# Altium project obc-comm.PrjPcb (part 1 of 2)
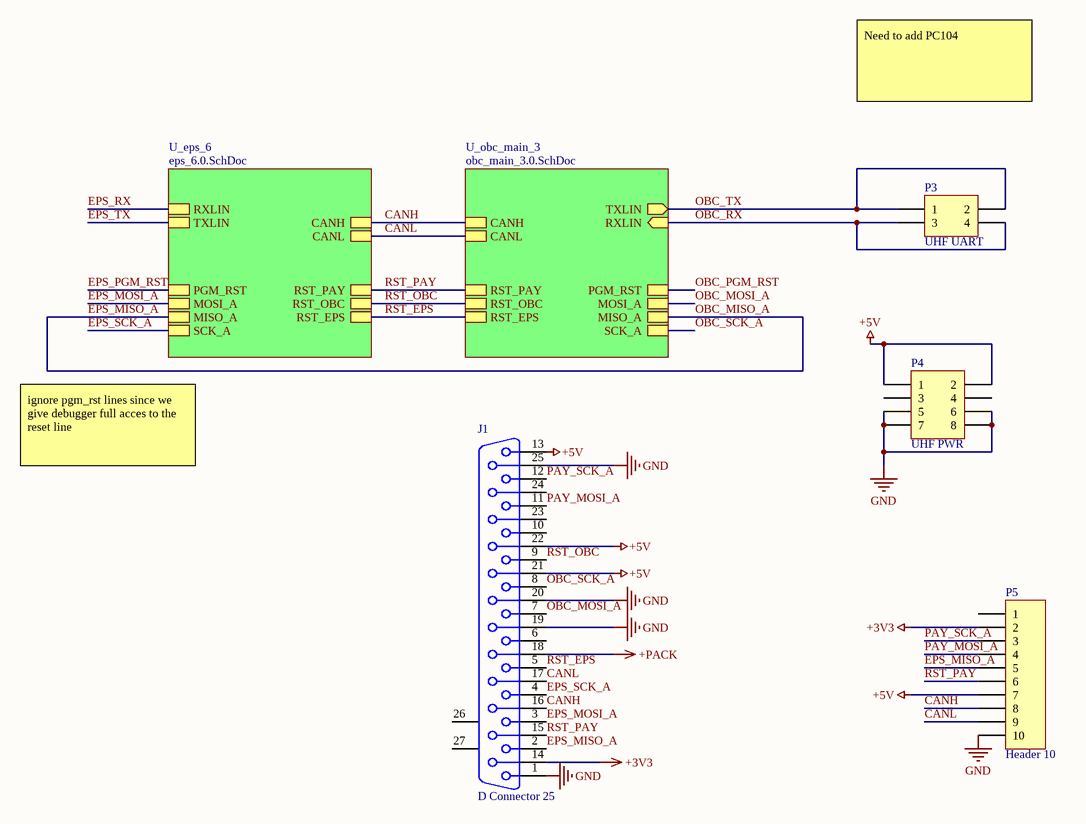
[diagram p0: bus-main.SchDoc]
19 sheets, 230 parts. Net scope: hierarchical (ports join the sheet entries above them; power ports are global).
Board file: obc_comm.PcbDoc
Sheets:
  bus-main.SchDoc
    U_obc_main_3 = obc_main_3.0.SchDoc
      U_obc_32m1 = obc_32m1.SchDoc
      U_obc_can_transceiver = obc_can_transceiver.SchDoc
      U_obc_flash = obc_flash.SchDoc
      U_obc_rtc = obc_rtc.SchDoc
      U_obc_flash = obc_flash.SchDoc
      U_obc_flash = obc_flash.SchDoc
    U_eps_6 = eps_6.0.SchDoc
      U_eps_digital = eps_digital.SchDoc
        U_eps_32m1 = eps_32m1.SchDoc
        U_eps_can_transceiver = eps_can_transceiver.SchDoc
        U_eps_flash = eps_flash.SchDoc
        U_eps_pex = eps_pex.SchDoc
        U_eps_adc = eps_adc.SchDoc
      U_eps_bb1 = eps_bb1.SchDoc
      U_eps_bb2 = eps_bb2.SchDoc
      U_eps_pv = eps_pv.SchDoc
      U_eps_bt1 = eps_bt1.SchDoc
      U_eps_bt2 = eps_bt2.SchDoc
      U_eps_batt = eps_batt.SchDoc

## Sheet bus-main.SchDoc
size A4

### Parts
J1  D Connector 25  [Mini DSub Connector]
P3  UHF UART  [HDR2X2]
P4  UHF PWR  [HDR2X4]
P5  Header 10  [DF14-10P-1.25H(55) - duplicate]

### Sub-sheets
U_eps_6 = eps_6.0.SchDoc: RXLIN, TXLIN, RST_PAY, RST_OBC, RST_EPS, SCK_A, PGM_RST, MOSI_A, MISO_A, CANL, CANH
U_obc_main_3 = obc_main_3.0.SchDoc: RST_OBC, RST_EPS, CANL, RST_PAY, CANH, TXLIN (out), RXLIN (in), PGM_RST, MOSI_A, MISO_A, SCK_A

### Nets
+3V3: J1.14 P5.2
+5V: J1.13 J1.21 J1.22 P4.1 P4.2 P5.7
+PACK: J1.18
GND: J1.1 J1.19 J1.20 J1.25 P4.5 P4.6 P4.7 P4.8 P5.10
CANH: J1.16 P5.8 ; sheet U_obc_main_3/CANH, sheet U_eps_6/CANH
CANL: J1.17 P5.9 ; sheet U_obc_main_3/CANL, sheet U_eps_6/CANL
EPS_MISO_A: J1.2 P5.5 ; sheet U_obc_main_3/MISO_A, sheet U_eps_6/MISO_A  [also labelled OBC_MISO_A]
EPS_MOSI_A: J1.3 ; sheet U_eps_6/TXLIN, sheet U_eps_6/MOSI_A  [also labelled EPS_TX]
EPS_SCK_A: J1.4 ; sheet U_eps_6/SCK_A
OBC_MOSI_A: J1.7 P3.1 P3.2 ; sheet U_obc_main_3/TXLIN, sheet U_obc_main_3/MOSI_A  [also labelled OBC_TX]  [project net MOSI_A]
OBC_RX: P3.3 P3.4 ; sheet U_obc_main_3/RXLIN
OBC_SCK_A: J1.8 ; sheet U_obc_main_3/SCK_A
PAY_MOSI_A: J1.11 P5.4
PAY_SCK_A: J1.12 P5.3
RST_EPS: J1.5 ; sheet U_obc_main_3/RST_EPS, sheet U_eps_6/RST_EPS
RST_OBC: J1.9 ; sheet U_obc_main_3/RST_OBC, sheet U_eps_6/RST_OBC  [project net RST]
RST_PAY: J1.15 P5.6 ; sheet U_obc_main_3/RST_PAY, sheet U_eps_6/RST_PAY

Not connected (* = marked no-connect by the designer): J1 6 10 23 24 26(MH1) 27(MH2); P4 3 4; P5 1

### Notes on the sheet
- Need to add PC104
- ignore pgm_rst lines since we give debugger full acces to the reset line

### Library data of the parts
J1 = D Connector 25: Receptacle Assembly, 25 Position, Right Angle; PackageDocument: U; Positions: 25; Published: 15-Jun-2001; LatestRevisionDate: 17-Jul-2002; LatestRevisionNote: Re-released for DXP Platform.; DatasheetDocument: 19-Mar-1999; PackageReference: 787202; Publisher: Altium Limited; Orientation: Right Angle; Gender: Receptacle; ComponentLink1Description: Mini-D25 - Molex, LLC 0836149012; ComponentLink1URL: https://www.digikey.ca/product-detail/en/molex-llc/0836149012/WM2144-ND/1867000
P3 = Header 2X2: Header, 2-Pin, Dual row; LatestRevisionDate: 17-Jul-2002; LatestRevisionNote: Re-released for DXP Platform.; Publisher: Altium Limited
P4 = Header 4X2: Header, 4-Pin, Dual row; LatestRevisionDate: 17-Jul-2002; LatestRevisionNote: Re-released for DXP Platform.; Publisher: Altium Limited
P5 = Header 10: Header, 10-Pin; LatestRevisionDate: 17-Jul-2002; LatestRevisionNote: Re-released for DXP Platform.; Publisher: Altium Limited

## Sheet obc_main_3.0.SchDoc
size A
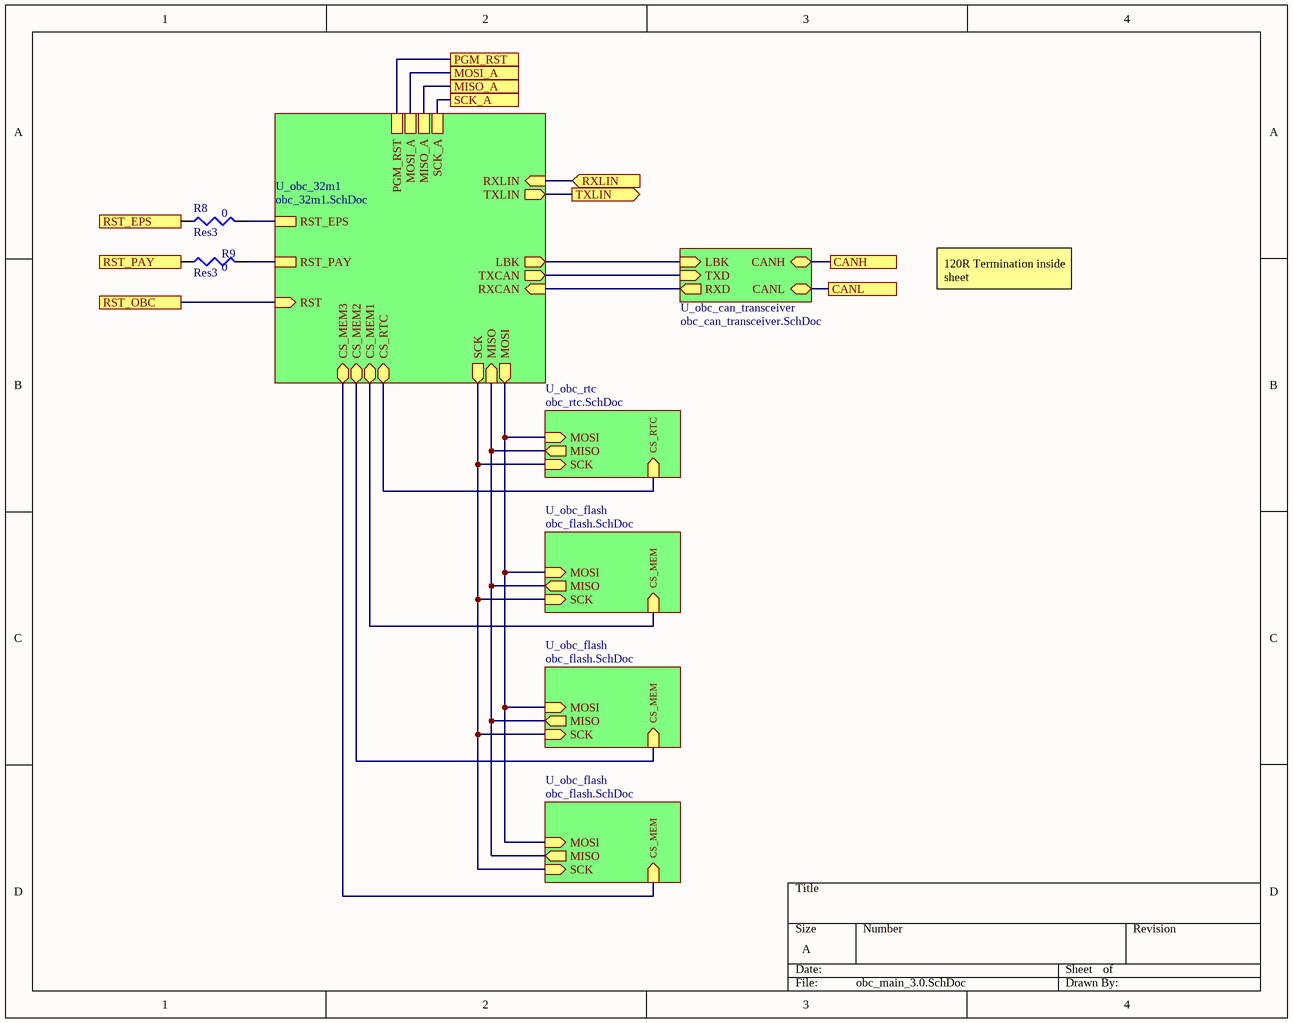
[diagram p1: obc_main_3.0.SchDoc]

### Parts
R8  Res3  value 0  [J1-0603]
R9  Res3  value 0  [J1-0603]

### Sub-sheets
U_obc_32m1 = obc_32m1.SchDoc: MISO (in), SCK (out), CS_MEM3 (bidir), CS_MEM1 (bidir), CS_MEM2 (bidir), RXLIN (in), CS_RTC (bidir), TXLIN (out), TXCAN (out), RXCAN (in), MOSI (out), LBK (out), RST (in), RST_EPS, RST_PAY, PGM_RST, MOSI_A, MISO_A, SCK_A
U_obc_can_transceiver = obc_can_transceiver.SchDoc: RXD (out), TXD (in), LBK (in), CANL (bidir), CANH (bidir)
U_obc_flash = obc_flash.SchDoc: MOSI (in), SCK (in), MISO (out), CS_MEM (in)
U_obc_flash = obc_flash.SchDoc: MOSI (in), SCK (in), MISO (out), CS_MEM (in)
U_obc_flash = obc_flash.SchDoc: MOSI (in), SCK (in), MISO (out), CS_MEM (in)
U_obc_rtc = obc_rtc.SchDoc: CS_RTC (in), MOSI (in), MISO (out), SCK (in)

### Ports
CANH, CANL, MISO_A, MOSI_A, PGM_RST, RST_EPS, RST_OBC, RST_PAY, RXLIN (in), SCK_A, TXLIN (out)

### Nets
CANH: port CANH, sheet U_obc_can_transceiver/CANH
CANL: port CANL, sheet U_obc_can_transceiver/CANL
EPS_MISO_A: port MISO_A, sheet U_obc_32m1/MISO_A
MOSI_A: port TXLIN, port MOSI_A, sheet U_obc_32m1/TXLIN, sheet U_obc_32m1/MOSI_A
OBC_PGM_RST: port PGM_RST, sheet U_obc_32m1/PGM_RST
OBC_RX: port RXLIN, sheet U_obc_32m1/RXLIN
OBC_SCK_A: port SCK_A, sheet U_obc_32m1/SCK_A
RST: port RST_OBC, sheet U_obc_32m1/RST
RST_EPS: R8.1 ; port RST_EPS
RST_PAY: R9.1 ; port RST_PAY
RXCAN: sheet U_obc_32m1/RXCAN, sheet U_obc_can_transceiver/RXD
TXCAN: sheet U_obc_32m1/TXCAN, sheet U_obc_can_transceiver/TXD
NetOBC-MEM1_1: sheet U_obc_32m1/CS_MEM3, sheet U_obc_flash/CS_MEM
NetOBC-MEM1_2: sheet U_obc_32m1/MISO, sheet U_obc_flash/MISO, sheet U_obc_rtc/MISO, sheet U_obc_flash/MISO, sheet U_obc_flash/MISO
NetOBC-MEM1_5: sheet U_obc_32m1/MOSI, sheet U_obc_flash/MOSI, sheet U_obc_rtc/MOSI, sheet U_obc_flash/MOSI, sheet U_obc_flash/MOSI
NetOBC-MEM1_6: sheet U_obc_32m1/SCK, sheet U_obc_flash/SCK, sheet U_obc_rtc/SCK, sheet U_obc_flash/SCK, sheet U_obc_flash/SCK
NetOBC-MEM2_1: sheet U_obc_32m1/CS_MEM2, sheet U_obc_flash/CS_MEM
NetOBC-MEM3_1: sheet U_obc_32m1/CS_MEM1, sheet U_obc_flash/CS_MEM
NetR8_2: R8.2 ; sheet U_obc_32m1/RST_EPS
NetR9_2: R9.2 ; sheet U_obc_32m1/RST_PAY
NetR30_2: sheet U_obc_32m1/LBK, sheet U_obc_can_transceiver/LBK
NetU1_26: sheet U_obc_32m1/CS_RTC, sheet U_obc_rtc/CS_RTC

### Notes on the sheet
- 120R Termination inside sheet

### Library data of the parts
R8 R9 = Res3: Resistor; Published: 8-Jun-2000; LatestRevisionDate: 29-May-2009; LatestRevisionNote: IPC-7351 Footprint Added.; PackageReference: J1-0603; Publisher: Altium Limited; PackageDescription: Chip Resistor

## Sheet obc_32m1.SchDoc
size A4
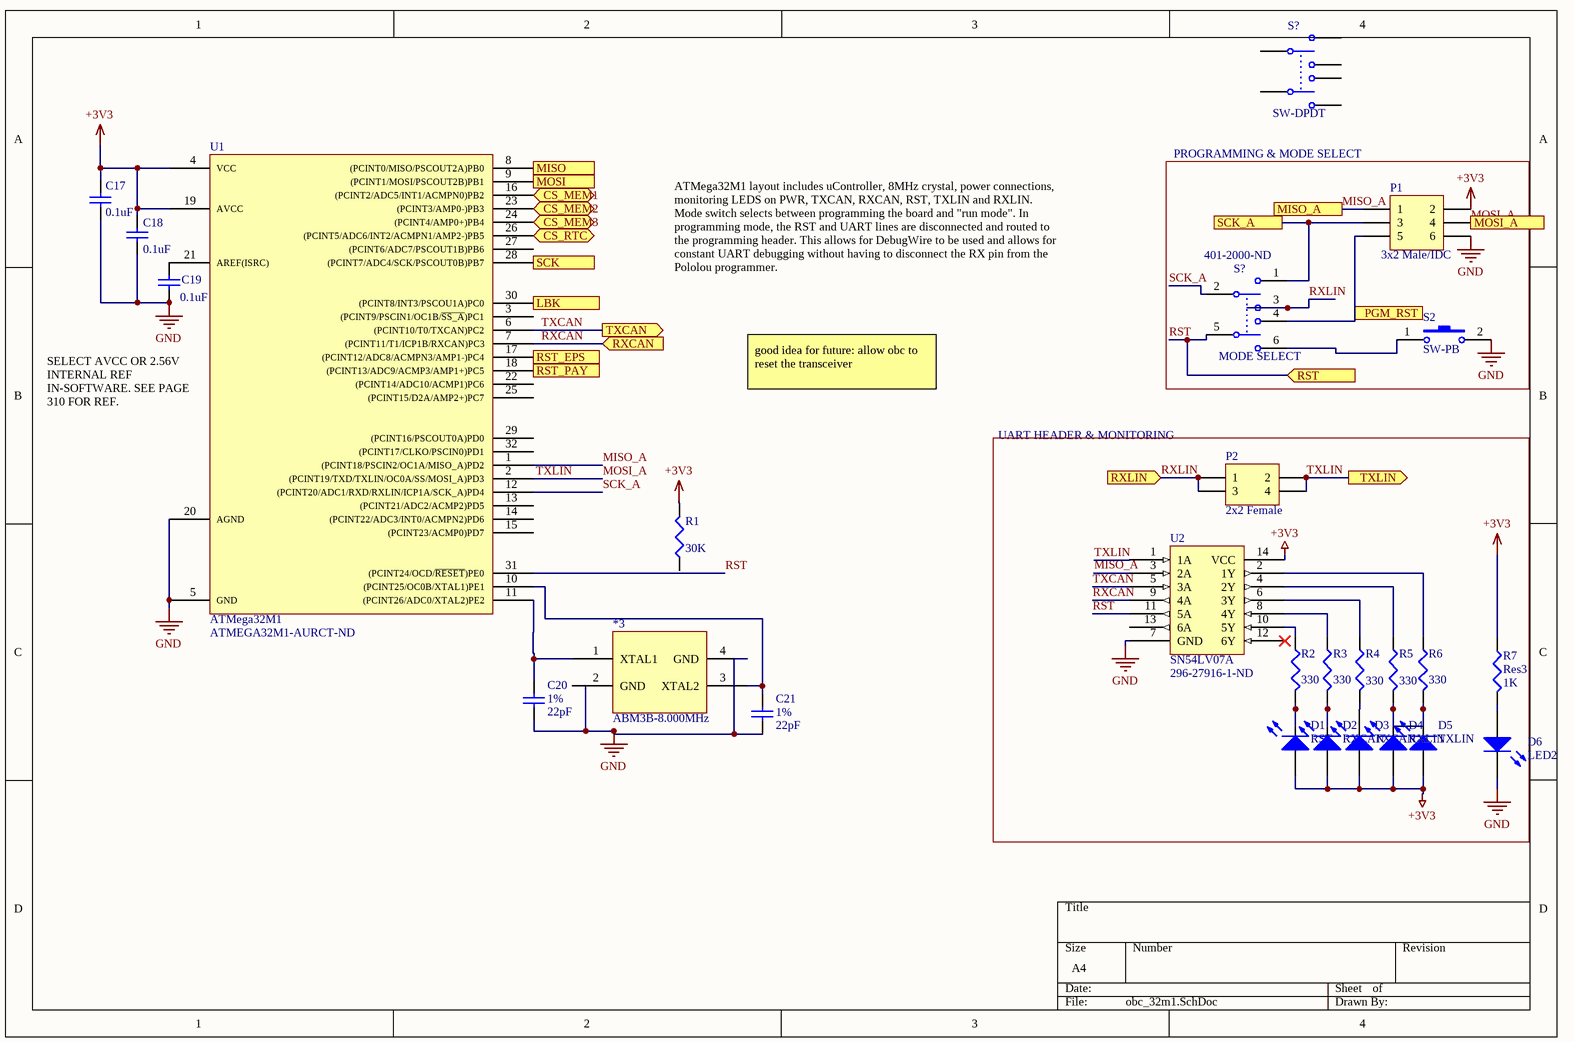
[diagram p2: obc_32m1.SchDoc]

### Parts
(Parts that share a designator on the sheet are numbered #1, #2 ... from top to bottom, then left to right.)
*3#1  ABM3B-8.000MHz  [OSCSC500X320X110-4N]
C17  value 0.1uF  [1608[0603]]  (hidden comment: Cap Semi)
C18  value 0.1uF  [1608[0603]]  (hidden comment: Cap Semi)
C19  value 0.1uF  [1608[0603]]  (hidden comment: Cap Semi)
C20  1%  value 22pF  [1608[0603]]
C21#1  1%  value 22pF  [1608[0603]]
D1  RST  [1608[0603]]
D2  RXCAN  [1608[0603]]
D3  TXCAN  [1608[0603]]
D4  RXLIN  [1608[0603]]
D5  TXLIN  [1608[0603]]
D6  LED2  [1608[0603]]
P1  3x2 Male/IDC  [HDR2X3]
P2  2x2 Female  [HDR2X2]
R1  value 30K  [J1-0603]
R2  value 330  [J1-0603]  (hidden comment: Res3)
R3  value 330  [J1-0603]  (hidden comment: Res3)
R4  value 330  [J1-0603]  (hidden comment: Res3)
R5  value 330  [J1-0603]  (hidden comment: Res3)
R6  value 330  [J1-0603]  (hidden comment: Res3)
R7  Res3  value 1K  [J1-0603]
S2  SW-PB  [SW415-ND]
S?#1  SW-DPDT  [DPST_32m1_switch]
S?#2  MODE SELECT  Supplier Part Number: 401-2000-ND  [DPST_32m1_switch]
U1  ATMega32M1  Supplier Part Number 1: ATMEGA32M1-AURCT-ND  [QFP80P900X900X120-32N]
U2  SN54LV07A  Supplier Part Number: 296-27916-1-ND  [SOP65P640X120-14N]

### Blocks framed on the sheet
PROGRAMMING & MODE SELECT: P1 S2 S?#2
UART HEADER & MONITORING: D1-D6 P2 R2-R7 U2

### Ports
CS_MEM1 (bidir), CS_MEM2 (bidir), CS_MEM3 (bidir), CS_RTC (bidir), LBK (out), MISO (in), MISO_A, MOSI (out), MOSI_A, PGM_RST, RST (in), RST_EPS, RST_PAY, RXCAN (in), RXLIN (in), SCK (out), SCK_A, TXCAN (out), TXLIN (out)

### Nets
+3V3: C17.2 C18.2 D1.1(A) D2.1(A) D3.1(A) D4.1(A) D5.1(A) P1.2 R1.2 R7.1 U1.4(VCC) U1.19(AVCC) U2.14(VCC)
GND: *3#1.4(GND) C17.1 C18.1 C19.2 C20.1 C21#1.1 D6.2(K) P1.6 S2.2 U1.5(GND) U1.20(AGND) U2.7(GND)
MISO_A: P1.1 U1.1((PCINT18/PSCIN2/OC1A/MISO_A)PD2) U2.3(2A) ; port MISO_A  [project net EPS_MISO_A]
MOSI_A: P1.4 P2.2 P2.4 U1.2((PCINT19/TXD/TXLIN/OC0A/SS/MOSI_A)PD3) U2.1(1A) ; port TXLIN, port MOSI_A  [also labelled TXLIN]
OBC_PGM_RST: P1.5 S?#2.4 ; port PGM_RST
OBC_SCK_A: P1.3 S?#2.1 ; port SCK_A
RST: S?#2.5 U1.31((PCINT24/OCD/~{RESET})PE0) U2.11(5A) ; port RST
RXCAN: U1.7((PCINT11/T1/ICP1B/RXCAN)PC3) U2.9(4A) ; port RXCAN
RXLIN: P2.1 P2.3 S?#2.3 ; port RXLIN  [project net OBC_RX]
SCK_A: S?#2.2 U1.12((PCINT20/ADC1/RXD/RXLIN/ICP1A/SCK_A)PD4)
TXCAN: U1.6((PCINT10/T0/TXCAN)PC2) U2.5(3A) ; port TXCAN
Net*3#1_1: *3#1.1(XTAL1) C20.2 U1.11((PCINT26/ADC0/XTAL2)PE2)
Net*3#1_3: *3#1.3(XTAL2) C21#1.2 U1.10((PCINT25/OC0B/XTAL1)PE1)
NetC19_1: C19.1 U1.21(AREF(ISRC))
NetD1_2: D1.2(K) R2.2
NetD2_2: D2.2(K) R3.2
NetD3_2: D3.2(K) R4.2
NetD4_2: D4.2(K) D5.2(K) R5.2 R6.2
NetD6_1: D6.1(A) R7.2
NetOBC-MEM1_1: U1.24((PCINT4/AMP0+)PB4) ; port CS_MEM3
NetOBC-MEM1_2: U1.8((PCINT0/MISO/PSCOUT2A)PB0) ; port MISO
NetOBC-MEM1_5: U1.9((PCINT1/MOSI/PSCOUT2B)PB1) ; port MOSI
NetOBC-MEM1_6: U1.28((PCINT7/ADC4/SCK/PSCOUT0B)PB7) ; port SCK
NetOBC-MEM2_1: U1.23((PCINT3/AMP0-)PB3) ; port CS_MEM2
NetOBC-MEM3_1: U1.16((PCINT2/ADC5/INT1/ACMPN0)PB2) ; port CS_MEM1
NetR2_1: R2.1 U2.10(5Y)
NetR3_1: R3.1 U2.8(4Y)
NetR4_1: R4.1 U2.6(3Y)
NetR5_1: R5.1 U2.4(2Y)
NetR6_1: R6.1 U2.2(1Y)
NetR8_2: U1.17((PCINT12/ADC8/ACMPN3/AMP1-)PC4) ; port RST_EPS
NetR9_2: U1.18((PCINT13/ADC9/ACMP3/AMP1+)PC5) ; port RST_PAY
NetR30_2: U1.30((PCINT8/INT3/PSCOU1A)PC0) ; port LBK
NetS2_1: S2.1 S?#2.6
NetU1_26: U1.26((PCINT5/ADC6/INT2/ACMPN1/AMP2-)PB5) ; port CS_RTC

Not connected (* = marked no-connect by the designer): *3#1 2(GND); R1 1; S?#1 1 2 3 4 5 6; U1 3((PCINT9/PSCIN1/OC1B/~{SS_A})PC1) 13((PCINT21/ADC2/ACMP2)PD5) 14((PCINT22/ADC3/INT0/ACMPN2)PD6) 15((PCINT23/ACMP0)PD7) 22((PCINT14/ADC10/ACMP1)PC6) 25((PCINT15/D2A/AMP2+)PC7) 27((PCINT6/ADC7/PSCOUT1B)PB6) 29((PCINT16/PSCOUT0A)PD0) 32((PCINT17/CLKO/PSCIN0)PD1); U2 12(6Y)* 13(6A)

### Notes on the sheet
- ATMega32M1 layout includes uController, 8MHz crystal, power connections, monitoring LEDS on PWR, TXCAN, RXCAN, RST, TXLIN and RXLIN. Mode switch selects between programming the board and "run mode". In programming mode, the RST and UART lines are disconnected and routed to the programming header. This allows for DebugWire to be used and allows for constant UART debugging without having to disconnect the RX pin from the Pololou programmer.
- good idea for future: allow obc to reset the transceiver
- (near U1) SELECT AVCC OR 2.56V INTERNAL REF IN-SOFTWARE. SEE PAGE 310 FOR REF.

### Library data of the parts
C17-C20 C21#1 = Cap Semi: Capacitor (Semiconductor SIM Model); Published: 8-Jun-2000; LatestRevisionDate: 29-May-2009; LatestRevisionNote: IPC-7351 Footprint Added.; PackageReference: C1206; Publisher: Altium Limited; PackageDescription: Chip Capacitor
D1-D6 = LED2: Typical RED, GREEN, YELLOW, AMBER GaAs LED; Published: 8-Jun-2000; LatestRevisionDate: 17-Jul-2002; LatestRevisionNote: Re-released for DXP Platform.; PackageVersion: Feb-2002; PackageReference: 3.2X1.6X1.1; Publisher: Altium Limited; PackageDescription: SM LED; 2 Flat Leads
P1 = Header 3X2: 2x3 through-hole programming header, IDC; LatestRevisionDate: 17-Jul-2002; LatestRevisionNote: Re-released for DXP Platform.; Publisher: Altium Limited
P2 = Header 2X2: Header, 2-Pin, Dual row; LatestRevisionDate: 17-Jul-2002; LatestRevisionNote: Re-released for DXP Platform.; Publisher: Altium Limited
R1 = Res3: 30K Pull-up resistor for RST. See page; Published: 8-Jun-2000; LatestRevisionDate: 29-May-2009; LatestRevisionNote: IPC-7351 Footprint Added.; PackageReference: J1-0603; Publisher: Altium Limited; PackageDescription: Chip Resistor
R2-R7 = Res3: Resistor; Published: 8-Jun-2000; LatestRevisionDate: 29-May-2009; LatestRevisionNote: IPC-7351 Footprint Added.; PackageReference: J1-0603; Publisher: Altium Limited; PackageDescription: Chip Resistor
S2 = SW-PB: Switch; Published: 24-Mar-1999; LatestRevisionDate: 17-Jul-2002; LatestRevisionNote: Re-released for DXP Platform.; PackageReference: SPST-2; Publisher: Altium Limited; PackageDescription: Switch; 2 Leads
S?#1 S?#2 = SW-DPDT: Double-Pole, Double-Throw Switch; Published: 24-Mar-1999; LatestRevisionDate: 17-Jul-2002; LatestRevisionNote: Re-released for DXP Platform.; PackageReference: DPDT-6; Publisher: Altium Limited; PackageDescription: Switch; 6 Leads
  S?#2: Supplier: Digi-Key
U1 = ATMega32M1: Atmel 8-bit AVR microcontroller.; Supplier 1: Digi-Key
U2 = SN54LV07A: Six element 1-bit non-inverting open-drain buffer.; Supplier: Digi-Key

## Sheet obc_can_transceiver.SchDoc
size A4
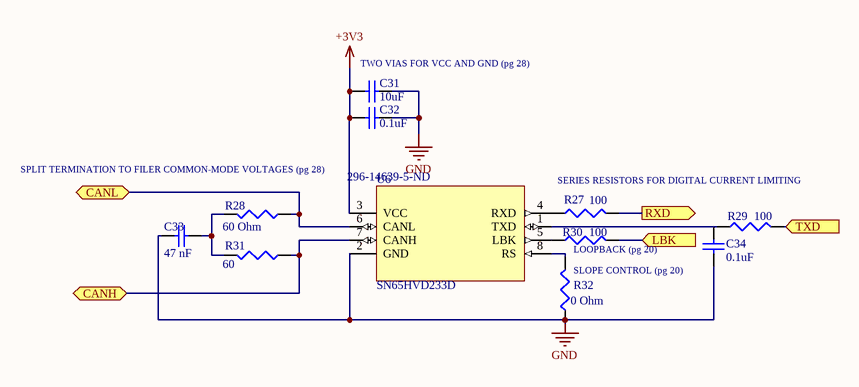
[diagram p3: obc_can_transceiver.SchDoc]

### Parts
C31  value 10uF  [1608[0603]]  (hidden comment: Cap Semi)
C32  value 0.1uF  [1608[0603]]  (hidden comment: Cap Semi)
C33  value 47 nF  [1608[0603]]  (hidden comment: Ceramic)
C34  0.1uF  [1608[0603]]
R27  value 100  [J1-0603]
R28  value 60 Ohm  [J1-0603]  (hidden comment: 0603)
R29  value 100  [J1-0603]
R30  100  [J1-0603]
R31  value 60  [J1-0603]  (hidden comment: 0603)
R32  value 0 Ohm  [J1-0603]
U6  SN65HVD233D  Supplier Part Number 1: 296-14639-5-ND  [SOIC127P500X600-8N]

### Ports
CANH (bidir), CANL (bidir), LBK (in), RXD (out), TXD (in)

### Nets
+3V3: C31.2 C32.2 U6.3(VCC)
GND: C31.1 C32.1 C33.1 C34.1 R32.1 U6.2(GND)
CANH: R31.1 U6.7(CANH) ; port CANH
CANL: R28.1 U6.6(CANL) ; port CANL
RXCAN: R27.2 ; port RXD
TXCAN: R29.2 ; port TXD
NetC33_2: C33.2 R28.2 R31.2
NetC34_2: C34.2 R29.1 U6.1(TXD)
NetR27_1: R27.1 U6.4(RXD)
NetR30_1: R30.1 U6.5(LBK)
NetR30_2: R30.2 ; port LBK
NetR32_2: R32.2 U6.8(RS)

### Notes on the sheet
- (near C31) TWO VIAS FOR VCC AND GND (pg 28)
- SPLIT TERMINATION TO FILER COMMON-MODE VOLTAGES (pg 28)
- SERIES RESISTORS FOR DIGITAL CURRENT LIMITING
- (near R32) SLOPE CONTROL (pg 20)
- (near R30) LOOPBACK (pg 20)

### Library data of the parts
C31-C34 = Cap Semi: Capacitor (Semiconductor SIM Model); Published: 8-Jun-2000; LatestRevisionDate: 29-May-2009; LatestRevisionNote: IPC-7351 Footprint Added.; PackageReference: C1206; Publisher: Altium Limited; PackageDescription: Chip Capacitor
  C34: Value: 0.1uF
R27-R32 = Res3: Resistor; Published: 8-Jun-2000; LatestRevisionDate: 29-May-2009; LatestRevisionNote: IPC-7351 Footprint Added.; PackageReference: J1-0603; Publisher: Altium Limited; PackageDescription: Chip Resistor
  R30: Value: 100
U6 = SN65HVD233D: 3.3V CAN Transceiver with Standby Mode, Loop-back 8-SOIC -40 to 125; MF: Texas Instruments; MP: SN65HVD233D; Package: SOIC-8 Texas Instruments; Availability: Good; SnapEDA_Link: https://www.snapeda.com/parts/SN65HVD233D/Texas%20Instruments/view-part/?ref=snap; Price: 2.39 USD; Value: *; Supplier 1: Digi-Key

## Sheet obc_flash.SchDoc
size A4
Used 3 times, as channels U_obc_main_3/U_obc_flash, U_obc_main_3/U_obc_flash, U_obc_main_3/U_obc_flash. Parts and nets are listed once, with the designators drawn on the sheet.
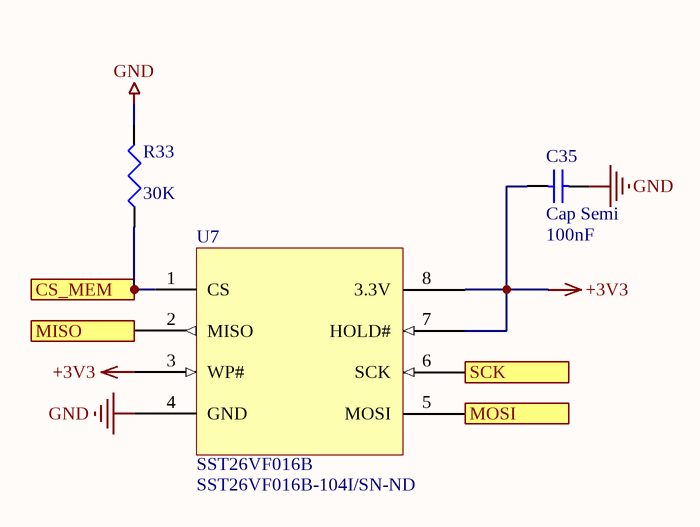
[diagram p4: obc_flash.SchDoc]

### Parts
C35  Cap Semi  value 100nF  [1608[0603]]
R33  value 30K  [J1-0603]
U7  SST26VF016B  Supplier Part Number 1: SST26VF016B-104I/SN-ND  [SOIC127P500X600-8N]

### Ports
CS_MEM (in), MISO (out), MOSI (in), SCK (in)

### Nets
+3V3: C35.1 U7.3(WP#) U7.7(HOLD#) U7.8(3.3V)
GND: C35.2 R33.2 U7.4(GND)
CS_MEM: R33.1 U7.1(CS) ; port CS_MEM
MISO: U7.2(MISO) ; port MISO
MOSI: U7.5(MOSI) ; port MOSI
SCK: U7.6(SCK) ; port SCK

### Channels
U_obc_main_3/U_obc_flash: designators C35=C35#1 R33=R33_U_obc_main_3_U_obc_flash#1 U7=OBC-MEM3; ports CS_MEM=NetOBC-MEM3_1 MISO=NetOBC-MEM1_2 MOSI=NetOBC-MEM1_5 SCK=NetOBC-MEM1_6
U_obc_main_3/U_obc_flash: designators C35=C35#2 R33=R33 U7=OBC-MEM2; ports CS_MEM=NetOBC-MEM2_1 MISO=NetOBC-MEM1_2 MOSI=NetOBC-MEM1_5 SCK=NetOBC-MEM1_6
U_obc_main_3/U_obc_flash: designators C35=C35#3 R33=R33_U_obc_main_3_U_obc_flash#2 U7=OBC-MEM1; ports CS_MEM=NetOBC-MEM1_1 MISO=NetOBC-MEM1_2 MOSI=NetOBC-MEM1_5 SCK=NetOBC-MEM1_6

### Library data of the parts
C35 = Cap Semi: Capacitor (Semiconductor SIM Model); Published: 8-Jun-2000; LatestRevisionDate: 29-May-2009; LatestRevisionNote: IPC-7351 Footprint Added.; PackageReference: C1206; Publisher: Altium Limited; PackageDescription: Chip Capacitor
R33 = Res3: 30K Pull-up resistor for RST. See page; Published: 8-Jun-2000; LatestRevisionDate: 29-May-2009; LatestRevisionNote: IPC-7351 Footprint Added.; PackageReference: J1-0603; Publisher: Altium Limited; PackageDescription: Chip Resistor
U7 = SST26VF016B: 2.5V/3.0V 16 Mbit Serial Quad I/O (SQI) Flash Memory; ComponentLink1Description: SST25VF016B; ComponentLink1URL: https://www.digikey.ca/product-detail/en/microchip-technology/SST26VF016B-104I-SN/SST26VF016B-104I-SN-ND/5033651; Supplier 1: Digi-Key

## Sheet obc_rtc.SchDoc
size A4
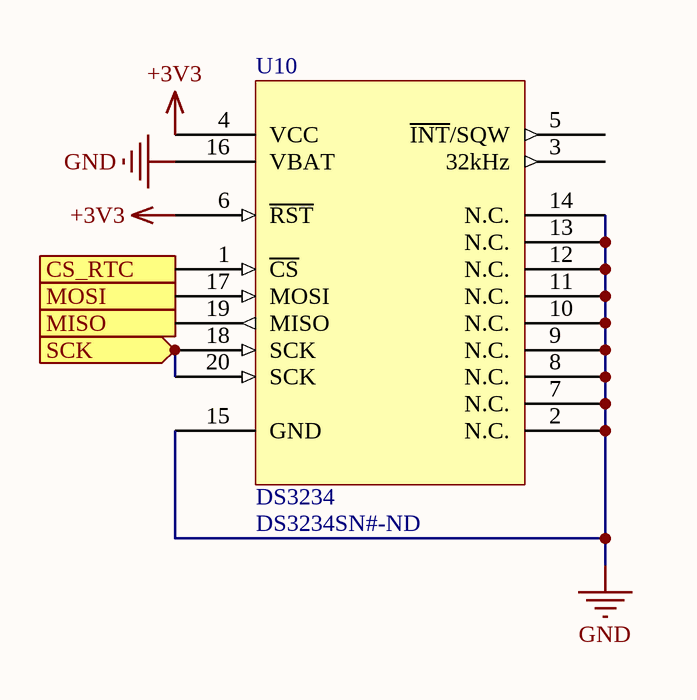
[diagram p5: obc_rtc.SchDoc]

### Parts
U10  DS3234  Supplier Part Number 1: DS3234SN#-ND  [SOIC127P1032X265-20N]

### Ports
CS_RTC (in), MISO (out), MOSI (in), SCK (in)

### Nets
+3V3: U10.4(VCC) U10.6(~{RST})
GND: U10.2(N.C.) U10.7(N.C.) U10.8(N.C.) U10.9(N.C.) U10.10(N.C.) U10.11(N.C.) U10.12(N.C.) U10.13(N.C.) U10.14(N.C.) U10.15(GND) U10.16(VBAT)
NetOBC-MEM1_2: U10.19(MISO) ; port MISO
NetOBC-MEM1_5: U10.17(MOSI) ; port MOSI
NetOBC-MEM1_6: U10.18(SCK) U10.20(SCK) ; port SCK
NetU1_26: U10.1(~{CS}) ; port CS_RTC

Not connected (* = marked no-connect by the designer): U10 3(32kHz) 5(~{INT}/SQW)

### Library data of the parts
U10 = DS3234: SPI bus RTC with integrated crystal and SRAM; Supplier 1: Digi-Key

## Sheet eps_6.0.SchDoc
size A
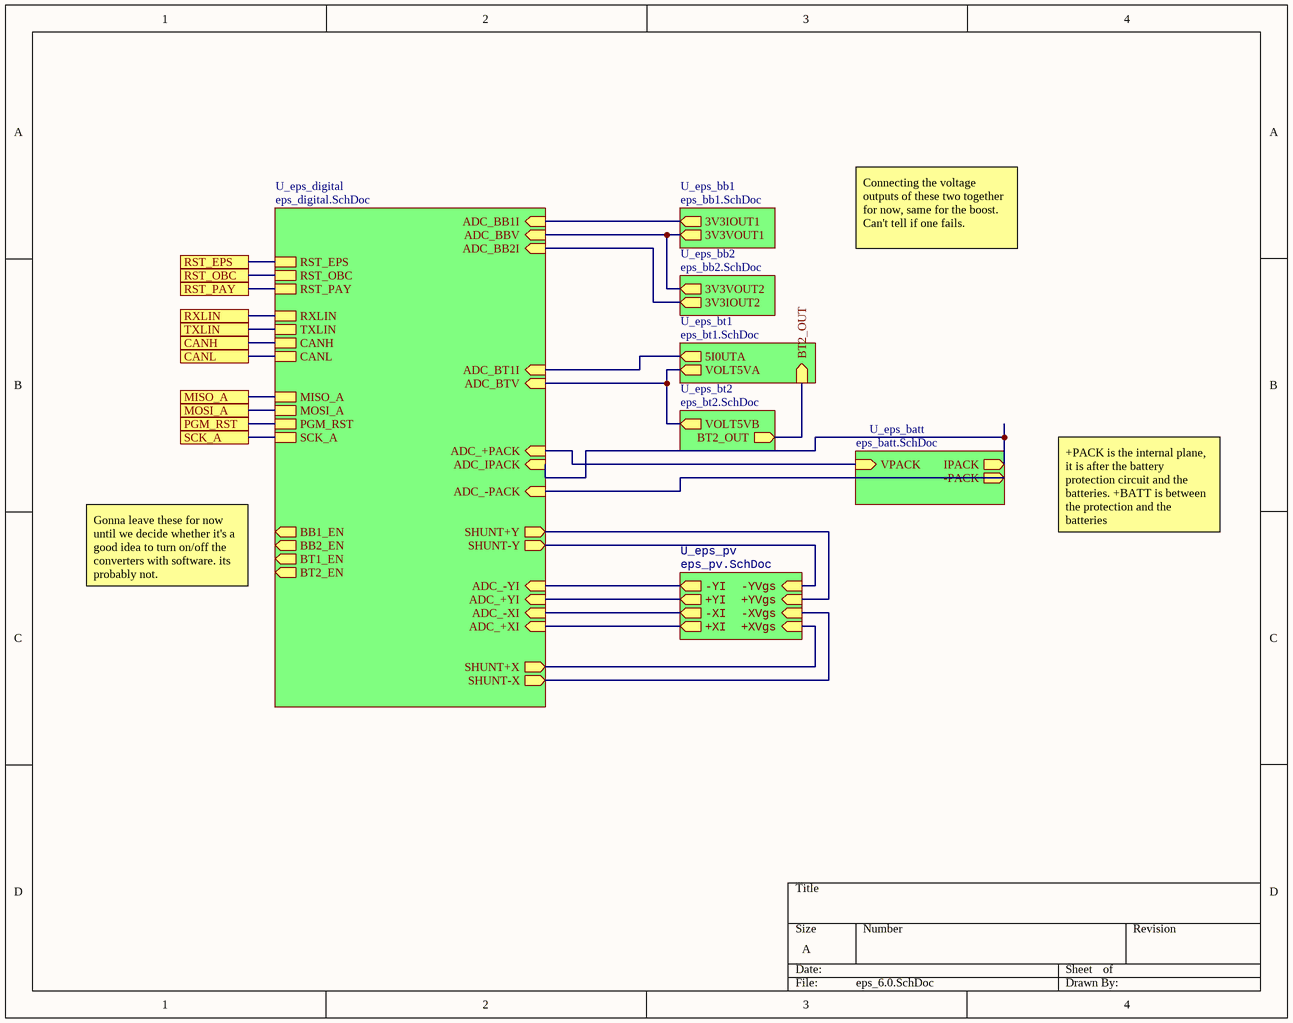
[diagram p6: eps_6.0.SchDoc]

### Sub-sheets
U_eps_batt = eps_batt.SchDoc: IPACK (out), VPACK (in), -PACK (out)
U_eps_bb1 = eps_bb1.SchDoc: 3V3IOUT1 (out), 3V3VOUT1 (out)
U_eps_bb2 = eps_bb2.SchDoc: 3V3IOUT2 (out), 3V3VOUT2 (out)
U_eps_bt1 = eps_bt1.SchDoc: VOLT5VA (out), 5I0UTA (out), BT2_OUT (in)
U_eps_bt2 = eps_bt2.SchDoc: VOLT5VB (out), BT2_OUT (out)
U_eps_digital = eps_digital.SchDoc: RST_EPS, RST_OBC, RST_PAY, RXLIN, TXLIN, CANH, CANL, MISO_A, MOSI_A, PGM_RST, SCK_A, ADC_BTV (in), BT1_EN (out), BT2_EN (out), ADC_BT1I (in), ADC_-PACK (in), ADC_BB1I (in), ADC_BB2I (in), ADC_+XI (in), ADC_-XI (in), ADC_+YI (in), ADC_+PACK (in), ADC_-YI (in), SHUNT-Y (out), SHUNT+Y (out), BB2_EN (out), BB1_EN (out), ADC_BBV (in), SHUNT-X (out), SHUNT+X (out), ADC_IPACK (in)
U_eps_pv = eps_pv.SchDoc: +YI (out), -YI (out), -YVgs (in), +XI (out), +YVgs (in), +XVgs (in), -XVgs (in), -XI (out)

### Ports
CANH, CANL, MISO_A, MOSI_A, PGM_RST, RST_EPS, RST_OBC, RST_PAY, RXLIN, SCK_A, TXLIN

### Nets
-PACK: sheet U_eps_digital/ADC_-PACK, sheet U_eps_batt/-PACK
CANH: port CANH, sheet U_eps_digital/CANH
CANL: port CANL, sheet U_eps_digital/CANL
EPS_MISO_A: port MISO_A, sheet U_eps_digital/MISO_A
EPS_MOSI_A: port TXLIN, port MOSI_A, sheet U_eps_digital/TXLIN, sheet U_eps_digital/MOSI_A
EPS_PGM_RST: port PGM_RST, sheet U_eps_digital/PGM_RST
EPS_RX: port RXLIN, sheet U_eps_digital/RXLIN
EPS_SCK_A: port SCK_A, sheet U_eps_digital/SCK_A
RST: port RST_OBC, sheet U_eps_digital/RST_OBC
RST_EPS: port RST_EPS, sheet U_eps_digital/RST_EPS
RST_PAY: port RST_PAY, sheet U_eps_digital/RST_PAY
Net1_1: sheet U_eps_bt1/BT2_OUT, sheet U_eps_bt2/BT2_OUT
Net5_1: sheet U_eps_digital/ADC_BTV, sheet U_eps_bt1/VOLT5VA, sheet U_eps_bt2/VOLT5VB
Net*2_7: sheet U_eps_digital/ADC_IPACK, sheet U_eps_batt/IPACK
Net*2_8: sheet U_eps_digital/ADC_+PACK, sheet U_eps_batt/VPACK
Net*2_9: sheet U_eps_digital/ADC_-YI, sheet U_eps_pv/-YI
Net*2_10: sheet U_eps_digital/ADC_+YI, sheet U_eps_pv/+YI
Net*2_11: sheet U_eps_digital/ADC_-XI, sheet U_eps_pv/-XI
Net*2_12: sheet U_eps_digital/ADC_+XI, sheet U_eps_pv/+XI
Net*2_14: sheet U_eps_digital/ADC_BT1I, sheet U_eps_bt1/5I0UTA
Net*2_16: sheet U_eps_digital/ADC_BB2I, sheet U_eps_bb2/3V3IOUT2
Net*2_17: sheet U_eps_digital/ADC_BB1I, sheet U_eps_bb1/3V3IOUT1
Net*2_18: sheet U_eps_digital/ADC_BBV, sheet U_eps_bb1/3V3VOUT1, sheet U_eps_bb2/3V3VOUT2
Net*14_3: sheet U_eps_digital/SHUNT+X, sheet U_eps_pv/+XVgs
Net*14_5: sheet U_eps_digital/SHUNT-X, sheet U_eps_pv/-XVgs
Net*14_10: sheet U_eps_digital/SHUNT+Y, sheet U_eps_pv/+YVgs
Net*14_12: sheet U_eps_digital/SHUNT-Y, sheet U_eps_pv/-YVgs

### Notes on the sheet
- Connecting the voltage outputs of these two together for now, same for the boost. Can't tell if one fails.
- +PACK is the internal plane, it is after the battery protection circuit and the batteries. +BATT is between the protection and the batteries
- Gonna leave these for now until we decide whether it's a good idea to turn on/off the converters with software. its probably not.

## Sheet eps_digital.SchDoc
size A4
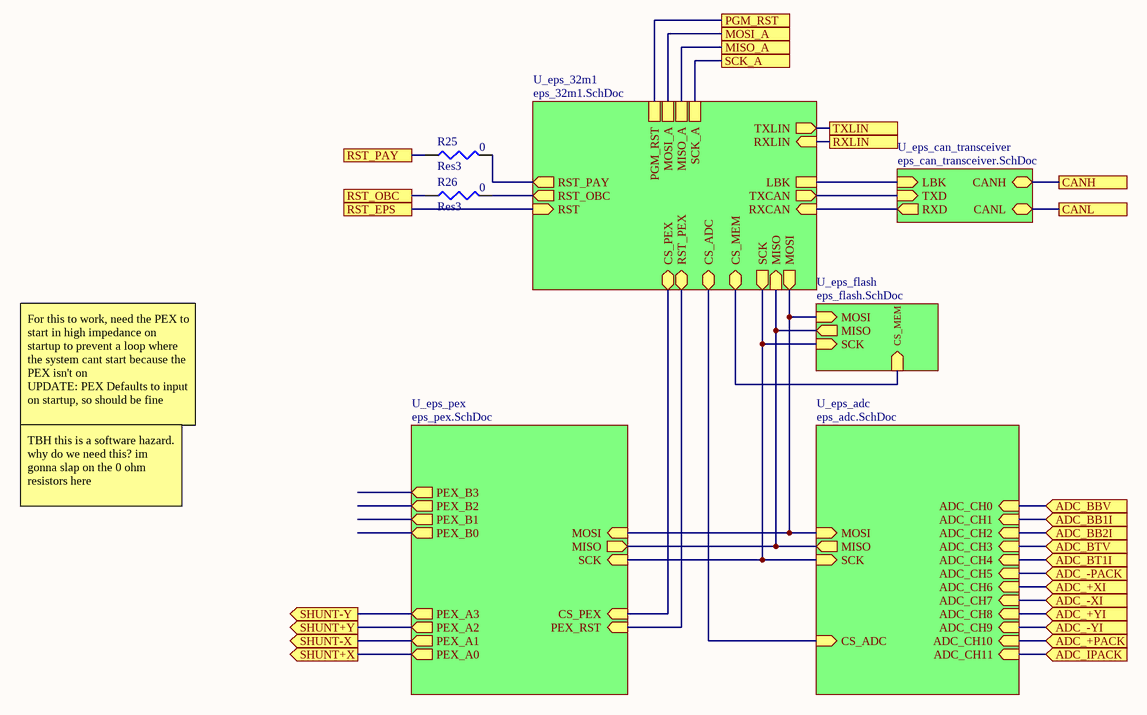
[diagram p7: eps_digital.SchDoc]

### Parts
(Parts that share a designator on the sheet are numbered #1, #2 ... from top to bottom, then left to right.)
R25#1  Res3  value 0  [J1-0603]
R26#1  Res3  value 0  [J1-0603]

### Sub-sheets
U_eps_32m1 = eps_32m1.SchDoc: MISO (in), SCK (out), TXLIN (out), MOSI (out), TXCAN (out), RXCAN (in), RXLIN (in), RST_OBC (out), RST_PAY (out), RST_PEX (bidir), CS_ADC (bidir), CS_PEX (bidir), CS_MEM (bidir), RST (in), LBK, PGM_RST, MOSI_A, MISO_A, SCK_A
U_eps_adc = eps_adc.SchDoc: ADC_CH10 (in), ADC_CH11 (in), ADC_CH9 (in), ADC_CH5 (in), ADC_CH6 (in), ADC_CH7 (in), ADC_CH3 (in), ADC_CH2 (in), ADC_CH8 (in), ADC_CH4 (in), ADC_CH1 (in), ADC_CH0 (in), MISO (out), MOSI (in), CS_ADC (in), SCK (in)
U_eps_can_transceiver = eps_can_transceiver.SchDoc: RXD (out), TXD (in), LBK (in), CANL (bidir), CANH (bidir)
U_eps_flash = eps_flash.SchDoc: SCK (in), CS_MEM (in), MOSI (in), MISO (out)
U_eps_pex = eps_pex.SchDoc: PEX_B0 (out), PEX_B1 (out), PEX_B2 (out), PEX_B3 (out), PEX_A1 (out), PEX_A2 (out), PEX_A0 (out), PEX_A3 (out), MISO (out), MOSI (in), SCK (in), CS_PEX (in), PEX_RST (in)

### Ports
ADC_+PACK (in), ADC_+XI (in), ADC_+YI (in), ADC_-PACK (in), ADC_-XI (in), ADC_-YI (in), ADC_BB1I (in), ADC_BB2I (in), ADC_BBV (in), ADC_BT1I (in), ADC_BTV (in), ADC_IPACK (in), CANH, CANL, MISO_A, MOSI_A, PGM_RST, RST_EPS, RST_OBC, RST_PAY, RXLIN, SCK_A, SHUNT+X (out), SHUNT+Y (out), SHUNT-X (out), SHUNT-Y (out), TXLIN

### Nets
-PACK: port ADC_-PACK, sheet U_eps_adc/ADC_CH5
CANH: port CANH, sheet U_eps_can_transceiver/CANH
CANL: port CANL, sheet U_eps_can_transceiver/CANL
EPS_MISO_A: port MISO_A, sheet U_eps_32m1/MISO_A
EPS_MOSI_A: port TXLIN, port MOSI_A, sheet U_eps_32m1/TXLIN, sheet U_eps_32m1/MOSI_A
EPS_PGM_RST: port PGM_RST, sheet U_eps_32m1/PGM_RST
EPS_RX: port RXLIN, sheet U_eps_32m1/RXLIN
EPS_SCK_A: port SCK_A, sheet U_eps_32m1/SCK_A
RST: R26#1.1 ; port RST_OBC
RST_EPS: port RST_EPS, sheet U_eps_32m1/RST
RST_PAY: R25#1.1 ; port RST_PAY
Net5_1: port ADC_BTV, sheet U_eps_adc/ADC_CH3
Net*2_7: port ADC_IPACK, sheet U_eps_adc/ADC_CH11
Net*2_8: port ADC_+PACK, sheet U_eps_adc/ADC_CH10
Net*2_9: port ADC_-YI, sheet U_eps_adc/ADC_CH9
Net*2_10: port ADC_+YI, sheet U_eps_adc/ADC_CH8
Net*2_11: port ADC_-XI, sheet U_eps_adc/ADC_CH7
Net*2_12: port ADC_+XI, sheet U_eps_adc/ADC_CH6
Net*2_14: port ADC_BT1I, sheet U_eps_adc/ADC_CH4
Net*2_16: port ADC_BB2I, sheet U_eps_adc/ADC_CH2
Net*2_17: port ADC_BB1I, sheet U_eps_adc/ADC_CH1
Net*2_18: port ADC_BBV, sheet U_eps_adc/ADC_CH0
Net*2_23: sheet U_eps_32m1/CS_ADC, sheet U_eps_adc/CS_ADC
Net*2_24: sheet U_eps_32m1/SCK, sheet U_eps_flash/SCK, sheet U_eps_pex/SCK, sheet U_eps_adc/SCK
Net*2_25: sheet U_eps_32m1/MOSI, sheet U_eps_flash/MOSI, sheet U_eps_pex/MOSI, sheet U_eps_adc/MOSI
Net*2_26: sheet U_eps_32m1/MISO, sheet U_eps_flash/MISO, sheet U_eps_pex/MISO, sheet U_eps_adc/MISO
Net*14_3: port SHUNT+X, sheet U_eps_pex/PEX_A0
Net*14_5: port SHUNT-X, sheet U_eps_pex/PEX_A1
Net*14_10: port SHUNT+Y, sheet U_eps_pex/PEX_A2
Net*14_12: port SHUNT-Y, sheet U_eps_pex/PEX_A3
NetR10_2: sheet U_eps_32m1/RST_PEX, sheet U_eps_pex/PEX_RST
NetR25#1_2: R25#1.2 ; sheet U_eps_32m1/RST_PAY
NetR26#1_2: R26#1.2 ; sheet U_eps_32m1/RST_OBC
NetR39_2: sheet U_eps_32m1/RXCAN, sheet U_eps_can_transceiver/RXD
NetR41#1_2: sheet U_eps_32m1/TXCAN, sheet U_eps_can_transceiver/TXD
NetR42#1_2: sheet U_eps_32m1/LBK, sheet U_eps_can_transceiver/LBK
NetU3_11: sheet U_eps_32m1/CS_PEX, sheet U_eps_pex/CS_PEX
NetU4_16: sheet U_eps_32m1/CS_MEM, sheet U_eps_flash/CS_MEM

### Notes on the sheet
- For this to work, need the PEX to start in high impedance on startup to prevent a loop where the system cant start because the PEX isn't on
  UPDATE: PEX Defaults to input on startup, so should be fine
- TBH this is a software hazard. why do we need this? im gonna slap on the 0 ohm resistors here

### Library data of the parts
R25#1 R26#1 = Res3: Resistor; Published: 8-Jun-2000; LatestRevisionDate: 29-May-2009; LatestRevisionNote: IPC-7351 Footprint Added.; PackageReference: J1-0603; Publisher: Altium Limited; PackageDescription: Chip Resistor

## Sheet eps_32m1.SchDoc
size A4
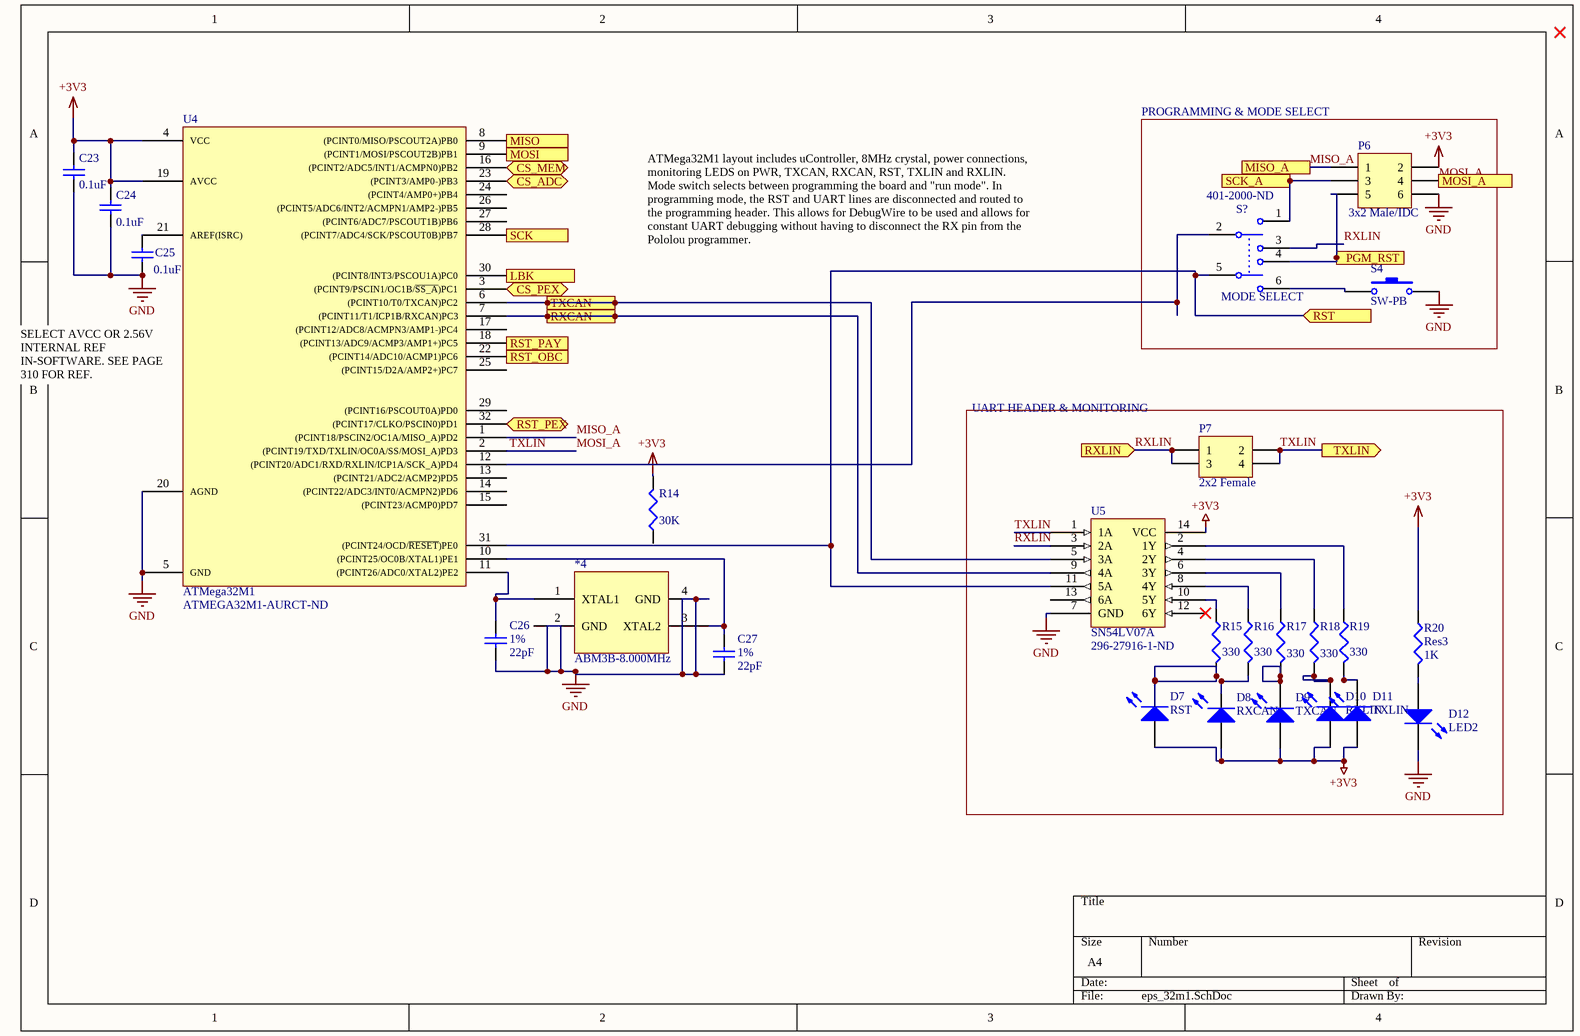
[diagram p8: eps_32m1.SchDoc]

### Parts
(Parts that share a designator on the sheet are numbered #1, #2 ... from top to bottom, then left to right.)
*4#1  ABM3B-8.000MHz  [OSCSC500X320X110-4N]
C23  value 0.1uF  [1608[0603]]  (hidden comment: Cap Semi)
C24  value 0.1uF  [1608[0603]]  (hidden comment: Cap Semi)
C25  value 0.1uF  [1608[0603]]  (hidden comment: Cap Semi)
C26  1%  value 22pF  [1608[0603]]
C27#1  1%  value 22pF  [1608[0603]]
D7  RST  [1608[0603]]
D8  RXCAN  [1608[0603]]
D9  TXCAN  [1608[0603]]
D10  RXLIN  [1608[0603]]
D11  TXLIN  [1608[0603]]
D12  LED2  [1608[0603]]
P6  3x2 Male/IDC  [HDR2X3]
P7  2x2 Female  [HDR2X2]
R14  value 30K  [J1-0603]
R15  value 330  [J1-0603]  (hidden comment: Res3)
R16  value 330  [J1-0603]  (hidden comment: Res3)
R17  value 330  [J1-0603]  (hidden comment: Res3)
R18  value 330  [J1-0603]  (hidden comment: Res3)
R19  value 330  [J1-0603]  (hidden comment: Res3)
R20  Res3  value 1K  [J1-0603]
S4  SW-PB  [SW415-ND]
S?#3  MODE SELECT  Supplier Part Number: 401-2000-ND  [DPST_32m1_switch]
U4  ATMega32M1  Supplier Part Number 1: ATMEGA32M1-AURCT-ND  [QFP80P900X900X120-32N]
U5  SN54LV07A  Supplier Part Number: 296-27916-1-ND  [SOP65P640X120-14N]

### Blocks framed on the sheet
PROGRAMMING & MODE SELECT: P6 S4 S?#3
UART HEADER & MONITORING: D7-D12 P7 R15-R20 U5

### Ports
CS_ADC (bidir), CS_MEM (bidir), CS_PEX (bidir), LBK, MISO (in), MISO_A, MOSI (out), MOSI_A, PGM_RST, RST (in), RST_OBC (out), RST_PAY (out), RST_PEX (bidir), RXCAN, RXLIN (in), SCK (out), SCK_A, TXCAN, TXLIN (out)

### Nets
+3V3: C23.2 C24.2 D7.1(A) D8.1(A) D9.1(A) D10.1(A) D11.1(A) P6.2 R14.2 R20.1 U4.4(VCC) U4.19(AVCC) U5.14(VCC)
GND: *4#1.4(GND) C23.1 C24.1 C25.2 C26.1 C27#1.1 D12.2(K) P6.6 S4.2 U4.5(GND) U4.20(AGND) U5.7(GND)
EPS_PGM_RST: P6.5 S?#3.4 ; port PGM_RST
EPS_SCK_A: P6.3 S?#3.1 ; port SCK_A
MISO_A: P6.1 U4.1((PCINT18/PSCIN2/OC1A/MISO_A)PD2) ; port MISO_A  [project net EPS_MISO_A]
MOSI_A: P6.4 P7.2 P7.4 U4.2((PCINT19/TXD/TXLIN/OC0A/SS/MOSI_A)PD3) U5.1(1A) ; port TXLIN, port MOSI_A  [also labelled TXLIN]  [project net EPS_MOSI_A]
RST_EPS: S?#3.5 U4.31((PCINT24/OCD/~{RESET})PE0) U5.11(5A) ; port RST
RXLIN: P7.1 P7.3 S?#3.3 U5.3(2A) ; port RXLIN  [project net EPS_RX]
Net*2_23: U4.23((PCINT3/AMP0-)PB3) ; port CS_ADC
Net*2_24: U4.28((PCINT7/ADC4/SCK/PSCOUT0B)PB7) ; port SCK
Net*2_25: U4.9((PCINT1/MOSI/PSCOUT2B)PB1) ; port MOSI
Net*2_26: U4.8((PCINT0/MISO/PSCOUT2A)PB0) ; port MISO
Net*4#1_1: *4#1.1(XTAL1) C26.2 U4.11((PCINT26/ADC0/XTAL2)PE2)
Net*4#1_3: *4#1.3(XTAL2) C27#1.2 U4.10((PCINT25/OC0B/XTAL1)PE1)
NetC25_1: C25.1 U4.21(AREF(ISRC))
NetD7_2: D7.2(K) R15.2
NetD8_2: D8.2(K) R16.2
NetD9_2: D9.2(K) R17.2
NetD10_2: D10.2(K) R18.2
NetD11_2: D11.2(K) R19.2
NetD12_1: D12.1(A) R20.2
NetR10_2: U4.32((PCINT17/CLKO/PSCIN0)PD1) ; port RST_PEX
NetR15_1: R15.1 U5.10(5Y)
NetR16_1: R16.1 U5.8(4Y)
NetR17_1: R17.1 U5.6(3Y)
NetR18_1: R18.1 U5.4(2Y)
NetR19_1: R19.1 U5.2(1Y)
NetR25#1_2: U4.18((PCINT13/ADC9/ACMP3/AMP1+)PC5) ; port RST_PAY
NetR26#1_2: U4.22((PCINT14/ADC10/ACMP1)PC6) ; port RST_OBC
NetR39_2: U4.7((PCINT11/T1/ICP1B/RXCAN)PC3) U5.9(4A) ; port RXCAN
NetR41#1_2: U4.6((PCINT10/T0/TXCAN)PC2) U5.5(3A) ; port TXCAN
NetR42#1_2: U4.30((PCINT8/INT3/PSCOU1A)PC0) ; port LBK
NetS4_1: S4.1 S?#3.6
NetS?#3_2: S?#3.2 U4.12((PCINT20/ADC1/RXD/RXLIN/ICP1A/SCK_A)PD4)
NetU3_11: U4.3((PCINT9/PSCIN1/OC1B/~{SS_A})PC1) ; port CS_PEX
NetU4_16: U4.16((PCINT2/ADC5/INT1/ACMPN0)PB2) ; port CS_MEM

Not connected (* = marked no-connect by the designer): *4#1 2(GND); R14 1; U4 13((PCINT21/ADC2/ACMP2)PD5) 14((PCINT22/ADC3/INT0/ACMPN2)PD6) 15((PCINT23/ACMP0)PD7) 17((PCINT12/ADC8/ACMPN3/AMP1-)PC4) 24((PCINT4/AMP0+)PB4) 25((PCINT15/D2A/AMP2+)PC7) 26((PCINT5/ADC6/INT2/ACMPN1/AMP2-)PB5) 27((PCINT6/ADC7/PSCOUT1B)PB6) 29((PCINT16/PSCOUT0A)PD0); U5 12(6Y)* 13(6A)

### Notes on the sheet
- ATMega32M1 layout includes uController, 8MHz crystal, power connections, monitoring LEDS on PWR, TXCAN, RXCAN, RST, TXLIN and RXLIN. Mode switch selects between programming the board and "run mode". In programming mode, the RST and UART lines are disconnected and routed to the programming header. This allows for DebugWire to be used and allows for constant UART debugging without having to disconnect the RX pin from the Pololou programmer.
- (near U4) SELECT AVCC OR 2.56V INTERNAL REF IN-SOFTWARE. SEE PAGE 310 FOR REF.

### Library data of the parts
C23-C26 C27#1 = Cap Semi: Capacitor (Semiconductor SIM Model); Published: 8-Jun-2000; LatestRevisionDate: 29-May-2009; LatestRevisionNote: IPC-7351 Footprint Added.; PackageReference: C1206; Publisher: Altium Limited; PackageDescription: Chip Capacitor
D7-D12 = LED2: as D1 on sheet obc_32m1; Published: 8-Jun-2000; LatestRevisionDate: 17-Jul-2002; LatestRevisionNote: Re-released for DXP Platform.; PackageVersion: Feb-2002; PackageReference: 3.2X1.6X1.1; Publisher: Altium Limited; PackageDescription: SM LED; 2 Flat Leads
P6 = Header 3X2: 2x3 through-hole programming header, IDC; LatestRevisionDate: 17-Jul-2002; LatestRevisionNote: Re-released for DXP Platform.; Publisher: Altium Limited
P7 = Header 2X2: Header, 2-Pin, Dual row; LatestRevisionDate: 17-Jul-2002; LatestRevisionNote: Re-released for DXP Platform.; Publisher: Altium Limited
R14 = Res3: 30K Pull-up resistor for RST. See page; Published: 8-Jun-2000; LatestRevisionDate: 29-May-2009; LatestRevisionNote: IPC-7351 Footprint Added.; PackageReference: J1-0603; Publisher: Altium Limited; PackageDescription: Chip Resistor
R15-R20 = Res3: Resistor; Published: 8-Jun-2000; LatestRevisionDate: 29-May-2009; LatestRevisionNote: IPC-7351 Footprint Added.; PackageReference: J1-0603; Publisher: Altium Limited; PackageDescription: Chip Resistor
S4 = SW-PB: Switch; Published: 24-Mar-1999; LatestRevisionDate: 17-Jul-2002; LatestRevisionNote: Re-released for DXP Platform.; PackageReference: SPST-2; Publisher: Altium Limited; PackageDescription: Switch; 2 Leads
S?#3 = SW-DPDT: Double-Pole, Double-Throw Switch; Published: 24-Mar-1999; LatestRevisionDate: 17-Jul-2002; LatestRevisionNote: Re-released for DXP Platform.; PackageReference: DPDT-6; Publisher: Altium Limited; PackageDescription: Switch; 6 Leads; Supplier: Digi-Key
U4 = ATMega32M1: Atmel 8-bit AVR microcontroller.; Supplier 1: Digi-Key
U5 = SN54LV07A: as U2 on sheet obc_32m1; Supplier: Digi-Key

## Sheet eps_can_transceiver.SchDoc
size A4
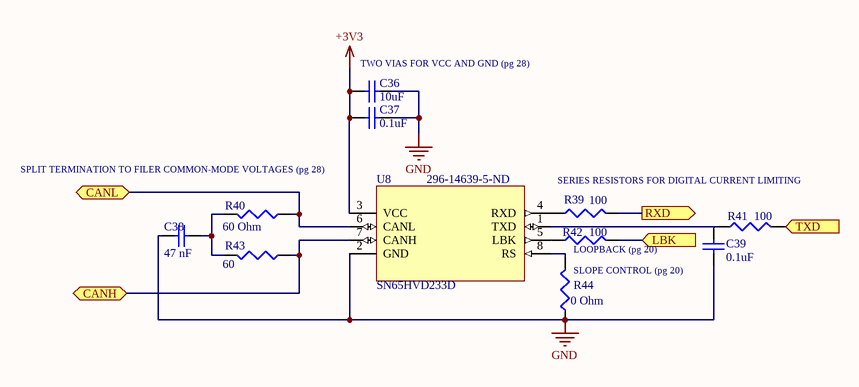
[diagram p9: eps_can_transceiver.SchDoc]

### Parts
(Parts that share a designator on the sheet are numbered #1, #2 ... from top to bottom, then left to right.)
C36  value 10uF  [1608[0603]]  (hidden comment: Cap Semi)
C37  value 0.1uF  [1608[0603]]  (hidden comment: Cap Semi)
C38  value 47 nF  [1608[0603]]  (hidden comment: Ceramic)
C39  0.1uF  [1608[0603]]
R39  value 100  [J1-0603]
R40#1  value 60 Ohm  [J1-0603]  (hidden comment: 0603)
R41#1  value 100  [J1-0603]
R42#1  100  [J1-0603]
R43#1  value 60  [J1-0603]  (hidden comment: 0603)
R44  value 0 Ohm  [J1-0603]
U8  SN65HVD233D  Supplier Part Number 1: 296-14639-5-ND  [SOIC127P500X600-8N]

### Ports
CANH (bidir), CANL (bidir), LBK (in), RXD (out), TXD (in)

### Nets
+3V3: C36.2 C37.2 U8.3(VCC)
GND: C36.1 C37.1 C38.1 C39.1 R44.1 U8.2(GND)
CANH: R43#1.1 U8.7(CANH) ; port CANH
CANL: R40#1.1 U8.6(CANL) ; port CANL
NetC38_2: C38.2 R40#1.2 R43#1.2
NetC39_2: C39.2 R41#1.1 U8.1(TXD)
NetR39_1: R39.1 U8.4(RXD)
NetR39_2: R39.2 ; port RXD
NetR41#1_2: R41#1.2 ; port TXD
NetR42#1_1: R42#1.1 U8.5(LBK)
NetR42#1_2: R42#1.2 ; port LBK
NetR44_2: R44.2 U8.8(RS)

### Notes on the sheet
- (near C36) TWO VIAS FOR VCC AND GND (pg 28)
- SPLIT TERMINATION TO FILER COMMON-MODE VOLTAGES (pg 28)
- SERIES RESISTORS FOR DIGITAL CURRENT LIMITING
- (near R44) SLOPE CONTROL (pg 20)
- (near R42#1) LOOPBACK (pg 20)

### Library data of the parts
C36-C39 = Cap Semi: Capacitor (Semiconductor SIM Model); Published: 8-Jun-2000; LatestRevisionDate: 29-May-2009; LatestRevisionNote: IPC-7351 Footprint Added.; PackageReference: C1206; Publisher: Altium Limited; PackageDescription: Chip Capacitor
  C39: Value: 0.1uF
R39 R40#1 R41#1 R42#1 R43#1 R44 = Res3: Resistor; Published: 8-Jun-2000; LatestRevisionDate: 29-May-2009; LatestRevisionNote: IPC-7351 Footprint Added.; PackageReference: J1-0603; Publisher: Altium Limited; PackageDescription: Chip Resistor
  R42#1: Value: 100
U8 = SN65HVD233D: as U6 on sheet obc_can_transceiver; MP: SN65HVD233D; Package: SOIC-8 Texas Instruments; Availability: Good; SnapEDA_Link: https://www.snapeda.com/parts/SN65HVD233D/Texas%20Instruments/view-part/?ref=snap; Price: 2.39 USD; Value: *; Supplier 1: Digi-Key

## Sheet eps_flash.SchDoc
size A4
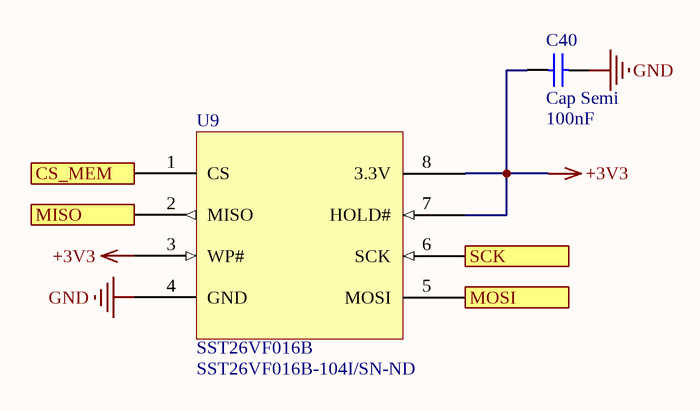
[diagram p10: eps_flash.SchDoc]

### Parts
C40  Cap Semi  value 100nF  [1608[0603]]
U9  SST26VF016B  Supplier Part Number 1: SST26VF016B-104I/SN-ND

### Ports
CS_MEM (in), MISO (out), MOSI (in), SCK (in)

### Nets
+3V3: C40.1 U9.3(WP#) U9.7(HOLD#) U9.8(3.3V)
GND: C40.2 U9.4(GND)
Net*2_24: U9.6(SCK) ; port SCK
Net*2_25: U9.5(MOSI) ; port MOSI
Net*2_26: U9.2(MISO) ; port MISO
NetU4_16: U9.1(CS) ; port CS_MEM

### Library data of the parts
C40 = Cap Semi: Capacitor (Semiconductor SIM Model); Published: 8-Jun-2000; LatestRevisionDate: 29-May-2009; LatestRevisionNote: IPC-7351 Footprint Added.; PackageReference: C1206; Publisher: Altium Limited; PackageDescription: Chip Capacitor
U9 = SST26VF016B: as U7 on sheet obc_flash; ComponentLink1Description: SST25VF016B; ComponentLink1URL: https://www.digikey.ca/product-detail/en/microchip-technology/SST26VF016B-104I-SN/SST26VF016B-104I-SN-ND/5033651; Supplier 1: Digi-Key

## Sheet eps_pex.SchDoc
size A4
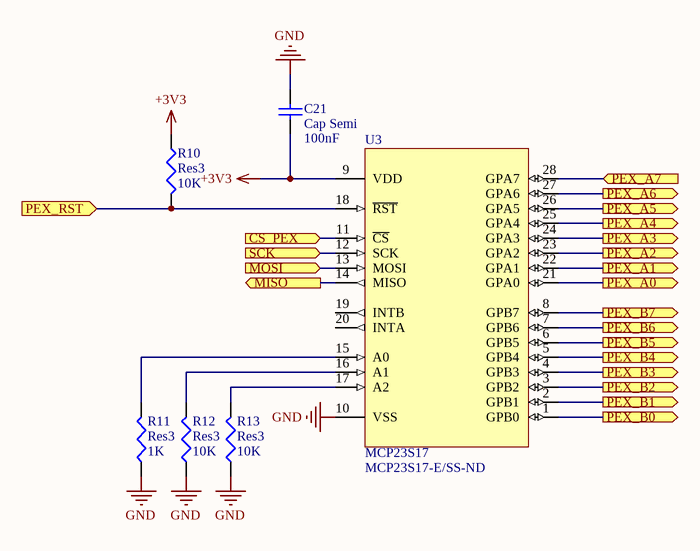
[diagram p11: eps_pex.SchDoc]

### Parts
(Parts that share a designator on the sheet are numbered #1, #2 ... from top to bottom, then left to right.)
C21#2  Cap Semi  value 100nF  [1608[0603]]
R10  Res3  value 10K  [J1-0603]
R11#1  Res3  value 1K  [J1-0603]
R12#1  Res3  value 10K  [J1-0603]
R13#1  Res3  value 10K  [J1-0603]
U3  MCP23S17  Supplier Part Number 1: MCP23S17-E/SS-ND  [SOP65P780X200-28N]

### Ports
CS_PEX (in), MISO (out), MOSI (in), PEX_A0 (out), PEX_A1 (out), PEX_A2 (out), PEX_A3 (out), PEX_A4 (out), PEX_A5 (out), PEX_A6 (out), PEX_A7 (in), PEX_B0 (out), PEX_B1 (out), PEX_B2 (out), PEX_B3 (out), PEX_B4 (out), PEX_B5 (out), PEX_B6 (out), PEX_B7 (out), PEX_RST (in), SCK (in)

### Nets
+3V3: C21#2.2 R10.1 U3.9(VDD)
GND: C21#2.1 R11#1.1 R12#1.1 R13#1.1 U3.10(VSS)
Net*2_24: U3.12(SCK) ; port SCK
Net*2_25: U3.13(MOSI) ; port MOSI
Net*2_26: U3.14(MISO) ; port MISO
Net*14_3: U3.21(GPA0) ; port PEX_A0
Net*14_5: U3.22(GPA1) ; port PEX_A1
Net*14_10: U3.23(GPA2) ; port PEX_A2
Net*14_12: U3.24(GPA3) ; port PEX_A3
NetR10_2: R10.2 U3.18(~{RST}) ; port PEX_RST
NetR11#1_2: R11#1.2 U3.15(A0)
NetR12#1_2: R12#1.2 U3.16(A1)
NetR13#1_2: R13#1.2 U3.17(A2)
NetU3_1: U3.1(GPB0) ; port PEX_B0
NetU3_2: U3.2(GPB1) ; port PEX_B1
NetU3_3: U3.3(GPB2) ; port PEX_B2
NetU3_4: U3.4(GPB3) ; port PEX_B3
NetU3_5: U3.5(GPB4) ; port PEX_B4
NetU3_6: U3.6(GPB5) ; port PEX_B5
NetU3_7: U3.7(GPB6) ; port PEX_B6
NetU3_8: U3.8(GPB7) ; port PEX_B7
NetU3_11: U3.11(~{CS}) ; port CS_PEX
NetU3_25: U3.25(GPA4) ; port PEX_A4
NetU3_26: U3.26(GPA5) ; port PEX_A5
NetU3_27: U3.27(GPA6) ; port PEX_A6
NetU3_28: U3.28(GPA7) ; port PEX_A7

Not connected (* = marked no-connect by the designer): U3 19(INTB) 20(INTA)

### Library data of the parts
C21#2 = Cap Semi: Capacitor (Semiconductor SIM Model); Published: 8-Jun-2000; LatestRevisionDate: 29-May-2009; LatestRevisionNote: IPC-7351 Footprint Added.; PackageReference: C1206; Publisher: Altium Limited; PackageDescription: Chip Capacitor
R10 R11#1 R12#1 R13#1 = Res3: Resistor; Published: 8-Jun-2000; LatestRevisionDate: 29-May-2009; LatestRevisionNote: IPC-7351 Footprint Added.; PackageReference: J1-0603; Publisher: Altium Limited; PackageDescription: Chip Resistor
U3 = MCP23S17: 16 bit I/O expander with SPI interface.; Supplier 1: Digi-Key

## Sheet eps_adc.SchDoc
size A4
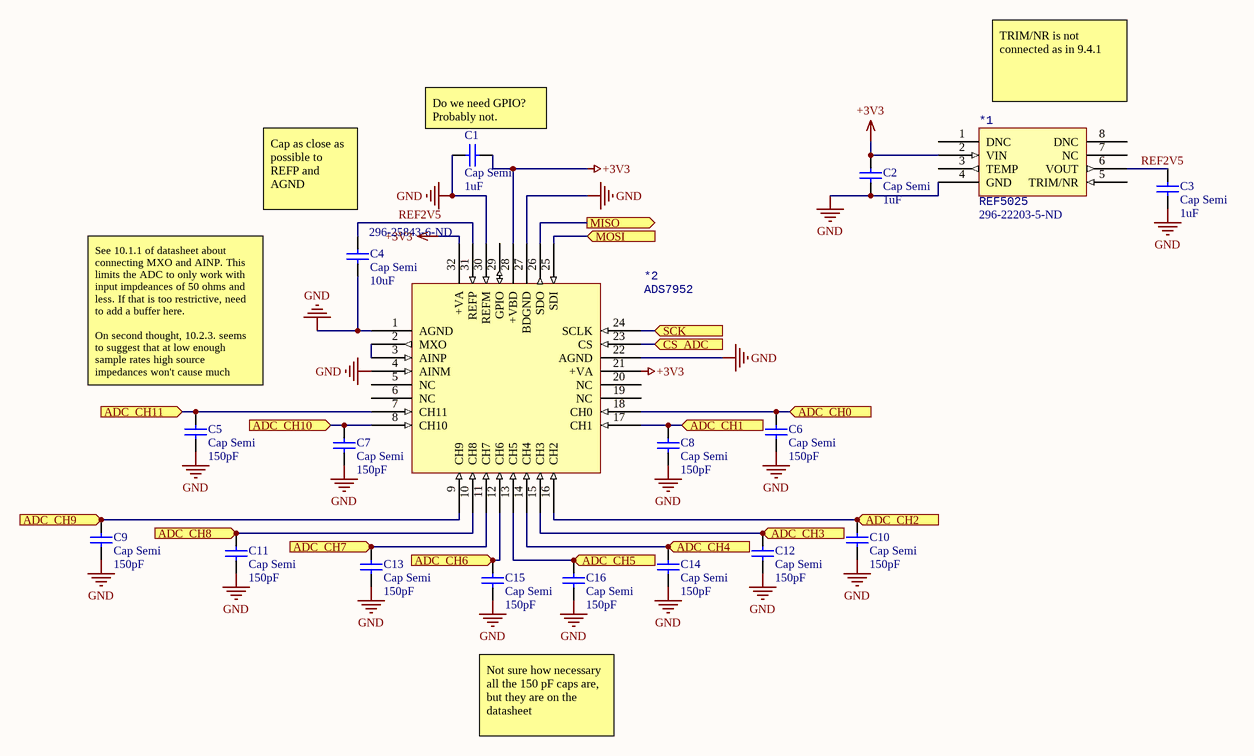
[diagram p12: eps_adc.SchDoc]

### Parts
(Parts that share a designator on the sheet are numbered #1, #2 ... from top to bottom, then left to right.)
*1  REF5025  Supplier Part Number 1: 296-22203-5-ND  [DGK8-M]
*2  ADS7952  Supplier Part Number 1: 296-25843-6-ND  [QFN50P500X500X100-32N]
C1  Cap Semi  value 1uF  [1608[0603]]
C2  Cap Semi  value 1uF  [1608[0603]]
C3  Cap Semi  value 1uF  [1608[0603]]
C4  Cap Semi  value 10uF  [1608[0603]]
C5  Cap Semi  value 150pF  [1608[0603]]
C6  Cap Semi  value 150pF  [1608[0603]]
C7  Cap Semi  value 150pF  [1608[0603]]
C8#1  Cap Semi  value 150pF  [1608[0603]]
C9  Cap Semi  value 150pF  [1608[0603]]
C10  Cap Semi  value 150pF  [1608[0603]]
C11  Cap Semi  value 150pF  [1608[0603]]
C12  Cap Semi  value 150pF  [1608[0603]]
C13#1  Cap Semi  value 150pF  [1608[0603]]
C14  Cap Semi  value 150pF  [1608[0603]]
C15  Cap Semi  value 150pF  [1608[0603]]
C16  Cap Semi  value 150pF  [1608[0603]]

### Ports
ADC_CH0 (in), ADC_CH1 (in), ADC_CH2 (in), ADC_CH3 (in), ADC_CH4 (in), ADC_CH5 (in), ADC_CH6 (in), ADC_CH7 (in), ADC_CH8 (in), ADC_CH9 (in), ADC_CH10 (in), ADC_CH11 (in), CS_ADC (in), MISO (out), MOSI (in), SCK (in)

### Nets
+3V3: *1.2(VIN) *2.21(+VA) *2.28(+VBD) *2.32(+VA) C1.1 C2.2
-PACK: *2.13(CH5) C16.1 ; port ADC_CH5
GND: *1.4(GND) *2.1(AGND) *2.4(AINM) *2.22(AGND) *2.27(BDGND) *2.30(REFM) C1.2 C2.1 C3.1 C4.2 C5.2 C6.2 C7.2 C8#1.2 C9.2 C10.2 C11.2 C12.2 C13#1.2 C14.2 C15.2 C16.2
REF2V5: *1.6(VOUT) *2.31(REFP) C3.2 C4.1
Net5_1: *2.15(CH3) C12.1 ; port ADC_CH3
Net*2_2: *2.2(MXO) *2.3(AINP)
Net*2_7: *2.7(CH11) C5.1 ; port ADC_CH11
Net*2_8: *2.8(CH10) C7.1 ; port ADC_CH10
Net*2_9: *2.9(CH9) C9.1 ; port ADC_CH9
Net*2_10: *2.10(CH8) C11.1 ; port ADC_CH8
Net*2_11: *2.11(CH7) C13#1.1 ; port ADC_CH7
Net*2_12: *2.12(CH6) C15.1 ; port ADC_CH6
Net*2_14: *2.14(CH4) C14.1 ; port ADC_CH4
Net*2_16: *2.16(CH2) C10.1 ; port ADC_CH2
Net*2_17: *2.17(CH1) C8#1.1 ; port ADC_CH1
Net*2_18: *2.18(CH0) C6.1 ; port ADC_CH0
Net*2_23: *2.23(CS) ; port CS_ADC
Net*2_24: *2.24(SCLK) ; port SCK
Net*2_25: *2.25(SDI) ; port MOSI
Net*2_26: *2.26(SDO) ; port MISO

Not connected (* = marked no-connect by the designer): *1 1(DNC) 3(TEMP) 5(TRIM/NR) 7(NC) 8(DNC); *2 5(NC) 6(NC) 19(NC) 20(NC) 29(GPIO)

### Notes on the sheet
- (near C1) Do we need GPIO? Probably not.
- (near *1) TRIM/NR is not connected as in 9.4.1
- (near C4) Cap as close as possible to REFP and AGND
- (near C5) See 10.1.1 of datasheet about connecting MXO and AINP. This limits the ADC to only work with input impdeances of 50 ohms and less. If that is too restrictive, need to add a buffer here.
  On second thought, 10.2.3. seems to suggest that at low enough sample rates high source impedances won't cause much issue.
- Not sure how necessary all the 150 pF caps are, but they are on the datasheet

### Library data of the parts
*1 = REF5025: Voltage Reference; Supplier 1: Digi-Key
*2 = ADS7952: ADC; Supplier 1: Digi-Key
C1-C7 C8#1 C9-C12 C13#1 C14-C16 = Cap Semi: Capacitor (Semiconductor SIM Model); Published: 8-Jun-2000; LatestRevisionDate: 29-May-2009; LatestRevisionNote: IPC-7351 Footprint Added.; PackageReference: C1206; Publisher: Altium Limited; PackageDescription: Chip Capacitor

## Sheet eps_bb1.SchDoc
size A4
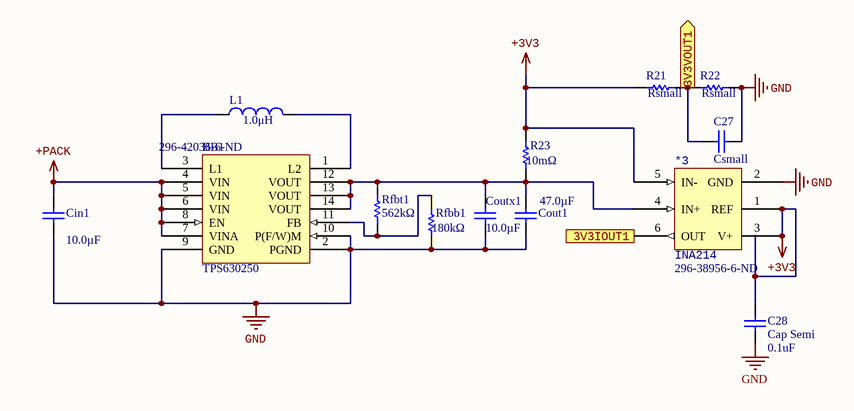
[diagram p13: eps_bb1.SchDoc]

### Parts
(Parts that share a designator on the sheet are numbered #1, #2 ... from top to bottom, then left to right.)
*3#2  INA214  Supplier Part Number 1: 296-38956-6-ND  [SOT65P210X110-6N]
BB1  TPS630250  Supplier Part Number 1: 296-42036-6-ND  [RNC0014A]
C27#2  value Csmall  [1608[0603]]  (hidden comment: Cap)
C28  Cap Semi  value 0.1uF  [1608[0603]]
Cin1  value 10.0µF  [1608[0603]]  (hidden comment: Cap)
Cout1  value 47.0µF  [1608[0603]]  (hidden comment: Cap)
Coutx1  value 10.0µF  [1608[0603]]  (hidden comment: Cap)
L1  value 1.0μH  [1608[0603]]  (hidden comment: Inductor)
R21  value Rsmall  [1608[0603]]  (hidden comment: Res1)
R22  value Rsmall  [1608[0603]]  (hidden comment: Res1)
R23#1  value 10mΩ  [1608[0603]]  (hidden comment: Res1)
Rfbb1  value 180kΩ  [1608[0603]]  (hidden comment: Res1)
Rfbt1  value 562kΩ  [1608[0603]]  (hidden comment: Rfbt1)

### Ports
3V3IOUT1 (out), 3V3VOUT1 (out)

### Nets
+3V3: *3#2.1(REF) *3#2.3(V+) *3#2.5(IN-) C28.2 R21.1 R23#1.2
+PACK: BB1.4(VIN) BB1.5(VIN) BB1.6(VIN) BB1.7(VINA) BB1.8(EN) Cin1.2
GND: *3#2.2(GND) BB1.2(PGND) BB1.9(GND) BB1.10(P(F/W)M) C27#2.1 C28.1 Cin1.1 Cout1.1 Coutx1.1 R22.2 Rfbb1.1
Net*2_17: *3#2.6(OUT) ; port 3V3IOUT1
Net*2_18: C27#2.2 R21.2 R22.1 ; port 3V3VOUT1
Net*3#2_4: *3#2.4(IN+) BB1.12(VOUT) BB1.13(VOUT) BB1.14(VOUT) Cout1.2 Coutx1.2 R23#1.1 Rfbt1.1
NetBB1_1: BB1.1(L2) L1.2
NetBB1_3: BB1.3(L1) L1.1
NetBB1_11: BB1.11(FB) Rfbb1.2 Rfbt1.2

### Library data of the parts
*3#2 = INA214: Current monitor; Supplier 1: Digi-Key
BB1 = TPS630250: Buck-boost converter; Supplier 1: Digi-Key
C27#2 Cin1 Cout1 Coutx1 = Cap: Capacitor; Published: 8-Jun-2000; LatestRevisionDate: 17-Jul-2002; LatestRevisionNote: Re-released for DXP Platform.; PackageReference: RAD-0.3; Publisher: Altium Limited; PackageDescription: Radial Cap, Thru-Hole; 2 Leads; 0.3 in Pin Spacing
C28 = Cap Semi: Capacitor (Semiconductor SIM Model); Published: 8-Jun-2000; LatestRevisionDate: 29-May-2009; LatestRevisionNote: IPC-7351 Footprint Added.; PackageReference: C1206; Publisher: Altium Limited; PackageDescription: Chip Capacitor
L1 = Inductor: Code_IEC: 1005; Published: 8-Jun-2000; LatestRevisionDate: 29-May-2009; LatestRevisionNote: IPC-7351 Footprint Added.; PackageReference: 0402-A; Publisher: Altium Limited; PackageDescription: Chip Inductor; Code_JEITA: 0402
R21 R22 R23#1 Rfbb1 Rfbt1 = Res1: Resistor; Published: 8-Jun-2000; LatestRevisionDate: 17-Jul-2002; LatestRevisionNote: Re-released for DXP Platform.; PackageReference: AXIAL-0.3; Publisher: Altium Limited; PackageDescription: Axial Device, Thru-Hole; 2 Leads; 0.3 in Pin Spacing

## Sheet eps_bb2.SchDoc
size A4
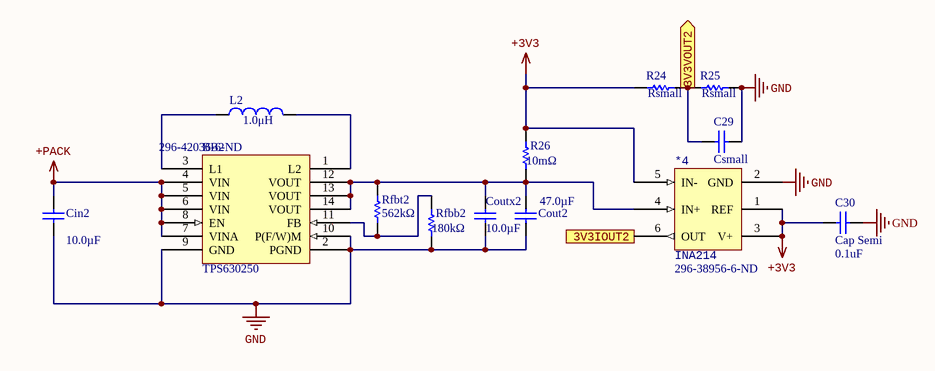
[diagram p14: eps_bb2.SchDoc]

### Parts
(Parts that share a designator on the sheet are numbered #1, #2 ... from top to bottom, then left to right.)
*4#2  INA214  Supplier Part Number 1: 296-38956-6-ND  [SOT65P210X110-6N]
BB2  TPS630250  Supplier Part Number 1: 296-42036-6-ND  [RNC0014A]
C29  value Csmall  [1608[0603]]  (hidden comment: Cap)
C30  Cap Semi  value 0.1uF  [1608[0603]]
Cin2  value 10.0µF  [1608[0603]]  (hidden comment: Cap)
Cout2  value 47.0µF  [1608[0603]]  (hidden comment: Cap)
Coutx2  value 10.0µF  [1608[0603]]  (hidden comment: Cap)
L2  value 1.0μH  [1608[0603]]  (hidden comment: Inductor)
R24#1  value Rsmall  [1608[0603]]  (hidden comment: Res1)
R25#2  value Rsmall  [1608[0603]]  (hidden comment: Res1)
R26#2  value 10mΩ  [1608[0603]]  (hidden comment: Res1)
Rfbb2  value 180kΩ  [1608[0603]]  (hidden comment: Res1)
Rfbt2  value 562kΩ  [1608[0603]]  (hidden comment: Rfbt1)

### Ports
3V3IOUT2 (out), 3V3VOUT2 (out)

### Nets
+3V3: *4#2.1(REF) *4#2.3(V+) *4#2.5(IN-) C30.2 R24#1.1 R26#2.2
+PACK: BB2.4(VIN) BB2.5(VIN) BB2.6(VIN) BB2.7(VINA) BB2.8(EN) Cin2.2
GND: *4#2.2(GND) BB2.2(PGND) BB2.9(GND) BB2.10(P(F/W)M) C29.1 C30.1 Cin2.1 Cout2.1 Coutx2.1 R25#2.2 Rfbb2.1
Net*2_16: *4#2.6(OUT) ; port 3V3IOUT2
Net*2_18: C29.2 R24#1.2 R25#2.1 ; port 3V3VOUT2
Net*4#2_4: *4#2.4(IN+) BB2.12(VOUT) BB2.13(VOUT) BB2.14(VOUT) Cout2.2 Coutx2.2 R26#2.1 Rfbt2.1
NetBB2_1: BB2.1(L2) L2.2
NetBB2_3: BB2.3(L1) L2.1
NetBB2_11: BB2.11(FB) Rfbb2.2 Rfbt2.2

### Library data of the parts
*4#2 = INA214: Current monitor; Supplier 1: Digi-Key
BB2 = TPS630250: Buck-boost converter; Supplier 1: Digi-Key
C29 Cin2 Cout2 Coutx2 = Cap: Capacitor; Published: 8-Jun-2000; LatestRevisionDate: 17-Jul-2002; LatestRevisionNote: Re-released for DXP Platform.; PackageReference: RAD-0.3; Publisher: Altium Limited; PackageDescription: Radial Cap, Thru-Hole; 2 Leads; 0.3 in Pin Spacing
C30 = Cap Semi: Capacitor (Semiconductor SIM Model); Published: 8-Jun-2000; LatestRevisionDate: 29-May-2009; LatestRevisionNote: IPC-7351 Footprint Added.; PackageReference: C1206; Publisher: Altium Limited; PackageDescription: Chip Capacitor
L2 = Inductor: Code_IEC: 1005; Published: 8-Jun-2000; LatestRevisionDate: 29-May-2009; LatestRevisionNote: IPC-7351 Footprint Added.; PackageReference: 0402-A; Publisher: Altium Limited; PackageDescription: Chip Inductor; Code_JEITA: 0402
R24#1 R25#2 R26#2 Rfbb2 Rfbt2 = Res1: Resistor; Published: 8-Jun-2000; LatestRevisionDate: 17-Jul-2002; LatestRevisionNote: Re-released for DXP Platform.; PackageReference: AXIAL-0.3; Publisher: Altium Limited; PackageDescription: Axial Device, Thru-Hole; 2 Leads; 0.3 in Pin Spacing

## Sheet eps_pv.SchDoc
size A4
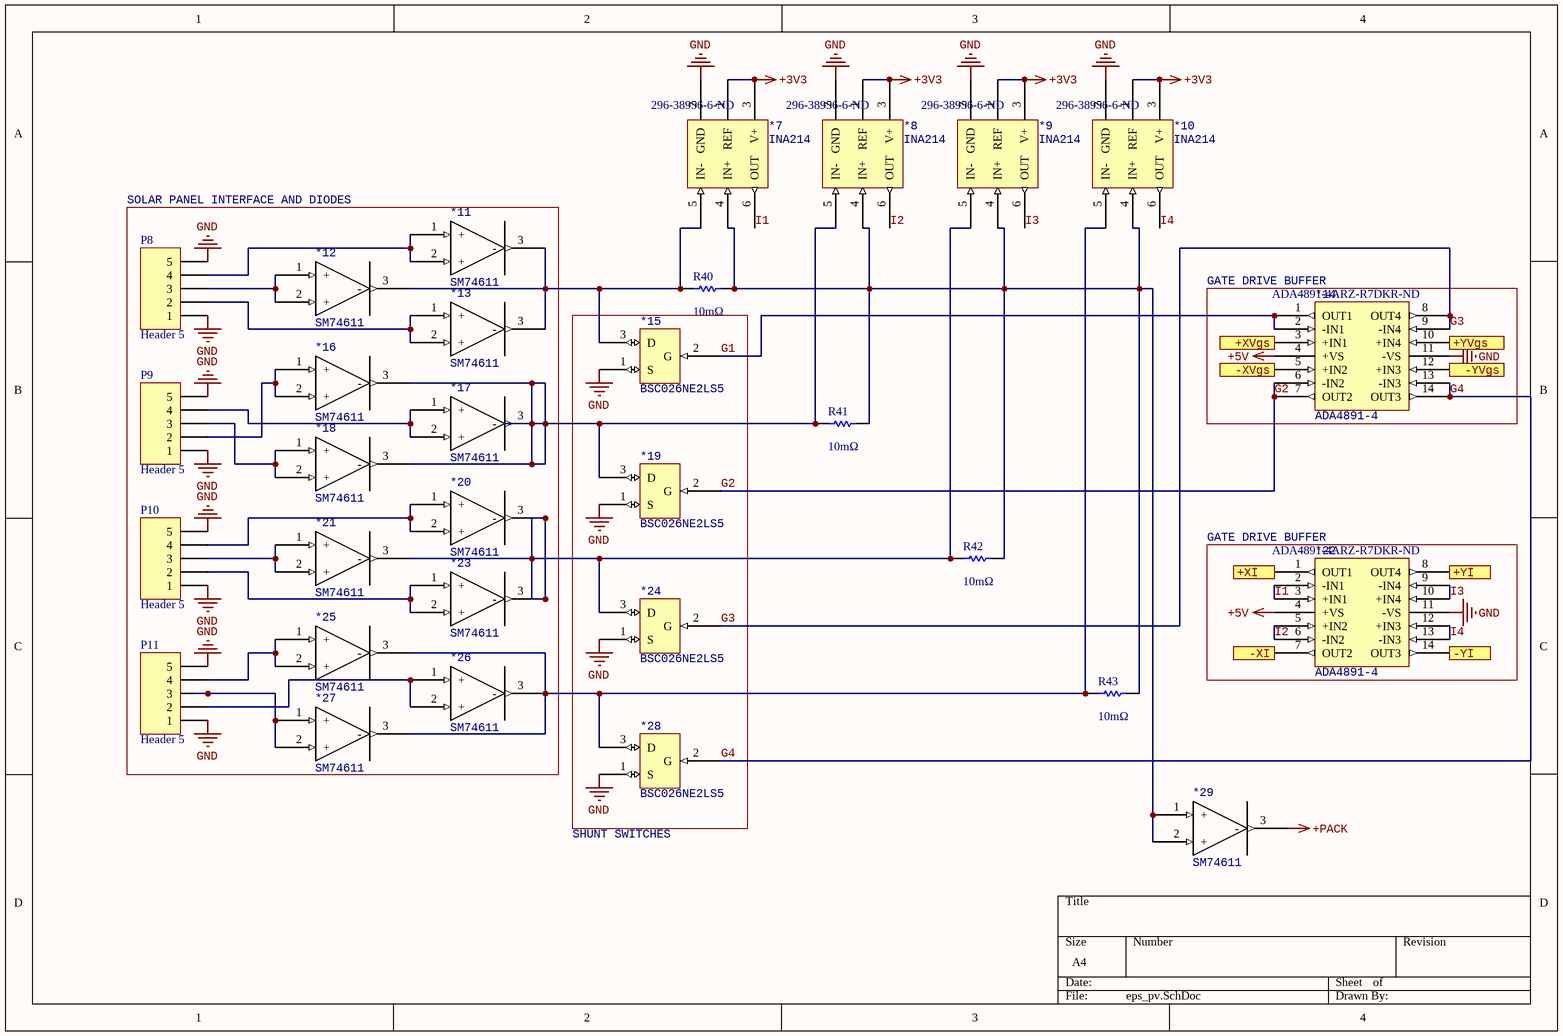
[diagram p15: eps_pv.SchDoc]

### Parts
(Parts that share a designator on the sheet are numbered #1, #2 ... from top to bottom, then left to right.)
*7  INA214  Supplier Part Number 1: 296-38956-6-ND  [SOT65P210X110-6N]
*8  INA214  Supplier Part Number 1: 296-38956-6-ND  [SOT65P210X110-6N]
*9  INA214  Supplier Part Number 1: 296-38956-6-ND  [SOT65P210X110-6N]
*10  INA214  Supplier Part Number 1: 296-38956-6-ND  [SOT65P210X110-6N]
*11  SM74611  [TO254P1435X464-3N]
*12  SM74611  [TO254P1435X464-3N]
*13  SM74611  [TO254P1435X464-3N]
*14  ADA4891-4  Supplier Part Number 1: ADA4891-4ARZ-R7DKR-ND  [R_14]
*15  BSC026NE2LS5  [INF-PG-TDSON-8-1_V]
*16  SM74611  [TO254P1435X464-3N]
*17  SM74611  [TO254P1435X464-3N]
*18  SM74611  [TO254P1435X464-3N]
*19  BSC026NE2LS5  [INF-PG-TDSON-8-1_V]
*20  SM74611  [TO254P1435X464-3N]
*21  SM74611  [TO254P1435X464-3N]
*22  ADA4891-4  Supplier Part Number 1: ADA4891-4ARZ-R7DKR-ND  [R_14]
*23  SM74611  [TO254P1435X464-3N]
*24  BSC026NE2LS5  [INF-PG-TDSON-8-1_V]
*25  SM74611  [TO254P1435X464-3N]
*26  SM74611  [TO254P1435X464-3N]
*27#1  SM74611  [TO254P1435X464-3N]
*28  BSC026NE2LS5  [INF-PG-TDSON-8-1_V]
*29  SM74611  [TO254P1435X464-3N]
P8  Header 5  [DF14-4P-1.25H(55) - duplicate]
P9  Header 5  [DF14-4P-1.25H(55) - duplicate]
P10  Header 5  [DF14-4P-1.25H(55) - duplicate]
P11  Header 5  [DF14-4P-1.25H(55) - duplicate]
R40#2  value 10mΩ  [1608[0603]]  (hidden comment: Res1)
R41#2  value 10mΩ  [1608[0603]]  (hidden comment: Res1)
R42#2  value 10mΩ  [1608[0603]]  (hidden comment: Res1)
R43#2  value 10mΩ  [1608[0603]]  (hidden comment: Res1)

### Blocks framed on the sheet
SOLAR PANEL INTERFACE AND DIODES: *11-*13 *16-*18 *20 *21 *23 *25 *26 *27#1 P8-P11
GATE DRIVE BUFFER: *14
GATE DRIVE BUFFER: *22

### Ports
+XI (out), +XVgs (in), +YI (out), +YVgs (in), -XI (out), -XVgs (in), -YI (out), -YVgs (in)

### Nets
+3V3: *7.1(REF) *7.3(V+) *8.1(REF) *8.3(V+) *9.1(REF) *9.3(V+) *10.1(REF) *10.3(V+)
+5V: *14.4(+VS) *22.4(+VS)
+PACK: *29.3(-)
GND: *7.2(GND) *8.2(GND) *9.2(GND) *10.2(GND) *14.11(-VS) *15.1(S) *19.1(S) *22.11(-VS) *24.1(S) *28.1(S) P8.1 P8.5 P9.1 P9.5 P10.1 P10.5 P11.1 P11.5
G1: *14.1(OUT1) *14.2(-IN1) *15.2(G)
G2: *14.6(-IN2) *14.7(OUT2) *19.2(G)
G3: *14.8(OUT4) *14.9(-IN4) *24.2(G)
G4: *14.13(-IN3) *14.14(OUT3) *28.2(G)
I1: *7.6(OUT) *22.2(-IN1) *22.3(+IN1)
I2: *8.6(OUT) *22.5(+IN2) *22.6(-IN2)
I3: *9.6(OUT) *22.9(-IN4) *22.10(+IN4)
I4: *10.6(OUT) *22.12(+IN3) *22.13(-IN3)
Net*2_9: *22.14(OUT3) ; port -YI
Net*2_10: *22.8(OUT4) ; port +YI
Net*2_11: *22.7(OUT2) ; port -XI
Net*2_12: *22.1(OUT1) ; port +XI
Net*7_4: *7.4(IN+) *8.4(IN+) *9.4(IN+) *10.4(IN+) *29.1(+) *29.2(+) R40#2.2 R41#2.2 R42#2.2 R43#2.2
Net*7_5: *7.5(IN-) *11.3(-) *12.3(-) *13.3(-) *15.3(D) R40#2.1
Net*8_5: *8.5(IN-) *16.3(-) *17.3(-) *18.3(-) *19.3(D) R41#2.1
Net*9_5: *9.5(IN-) *20.3(-) *21.3(-) *23.3(-) *24.3(D) R42#2.1
Net*10_5: *10.5(IN-) *25.3(-) *26.3(-) *27#1.3(-) *28.3(D) R43#2.1
Net*11_1: *11.1(+) *11.2(+) P8.4
Net*12_1: *12.1(+) *12.2(+) P8.3
Net*13_1: *13.1(+) *13.2(+) P8.2
Net*14_3: *14.3(+IN1) ; port +XVgs
Net*14_5: *14.5(+IN2) ; port -XVgs
Net*14_10: *14.10(+IN4) ; port +YVgs
Net*14_12: *14.12(+IN3) ; port -YVgs
Net*16_1: *16.1(+) *16.2(+) P9.2
Net*17_1: *17.1(+) *17.2(+) P9.4
Net*18_1: *18.1(+) *18.2(+) P9.3
Net*20_1: *20.1(+) *20.2(+) P10.4
Net*21_1: *21.1(+) *21.2(+) P10.3
Net*23_1: *23.1(+) *23.2(+) P10.2
Net*25_1: *25.1(+) *25.2(+) P11.4
Net*26_1: *26.1(+) *26.2(+) P11.2
Net*27#1_1: *27#1.1(+) *27#1.2(+) P11.3

### Notes on the sheet
- SHUNT SWITCHES

### Library data of the parts
*7-*10 = INA214: Current monitor; Supplier 1: Digi-Key
*11-*13 *16-*18 *20 *21 *23 *25 *26 *27#1 *29 = SM74611: PV Diode
*14 *22 = ADA4891-4: Op-amps; Supplier 1: Digi-Key
*15 *19 *24 *28 = BSC026NE2LS5: MOSFET
P8-P11 = Header 5: Header, 5-Pin; LatestRevisionDate: 17-Jul-2002; LatestRevisionNote: Re-released for DXP Platform.; Publisher: Altium Limited
R40#2 R41#2 R42#2 R43#2 = Res1: Resistor; Published: 8-Jun-2000; LatestRevisionDate: 17-Jul-2002; LatestRevisionNote: Re-released for DXP Platform.; PackageReference: AXIAL-0.3; Publisher: Altium Limited; PackageDescription: Axial Device, Thru-Hole; 2 Leads; 0.3 in Pin Spacing